# EAGLE design SensorInterface (EAGLE 8.4.1)
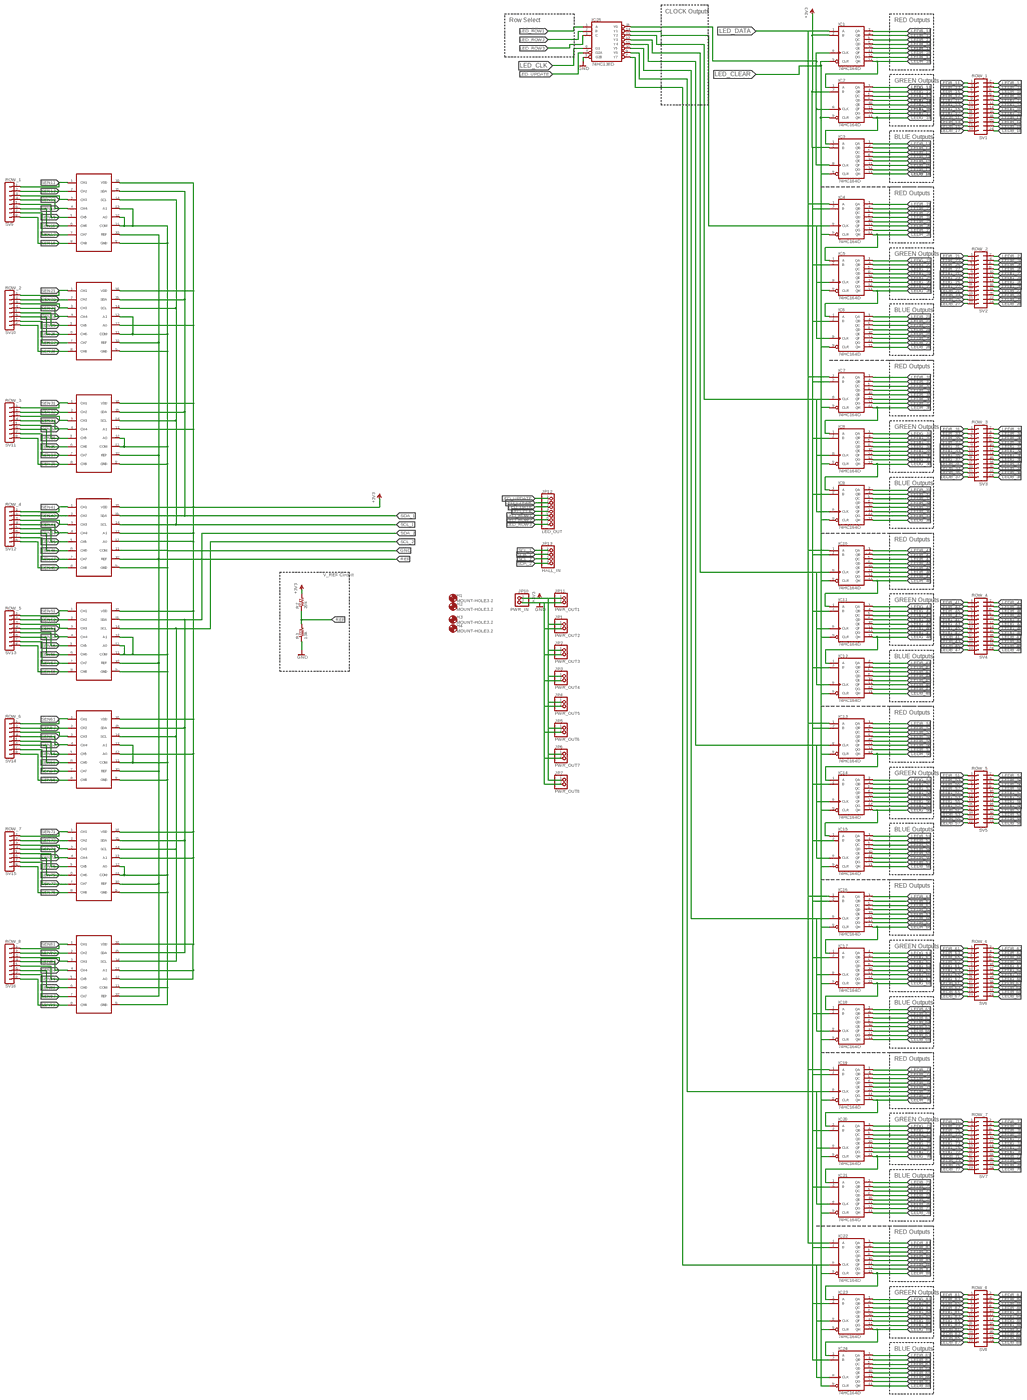
[diagram p0: schematic, sheet 1, overview]
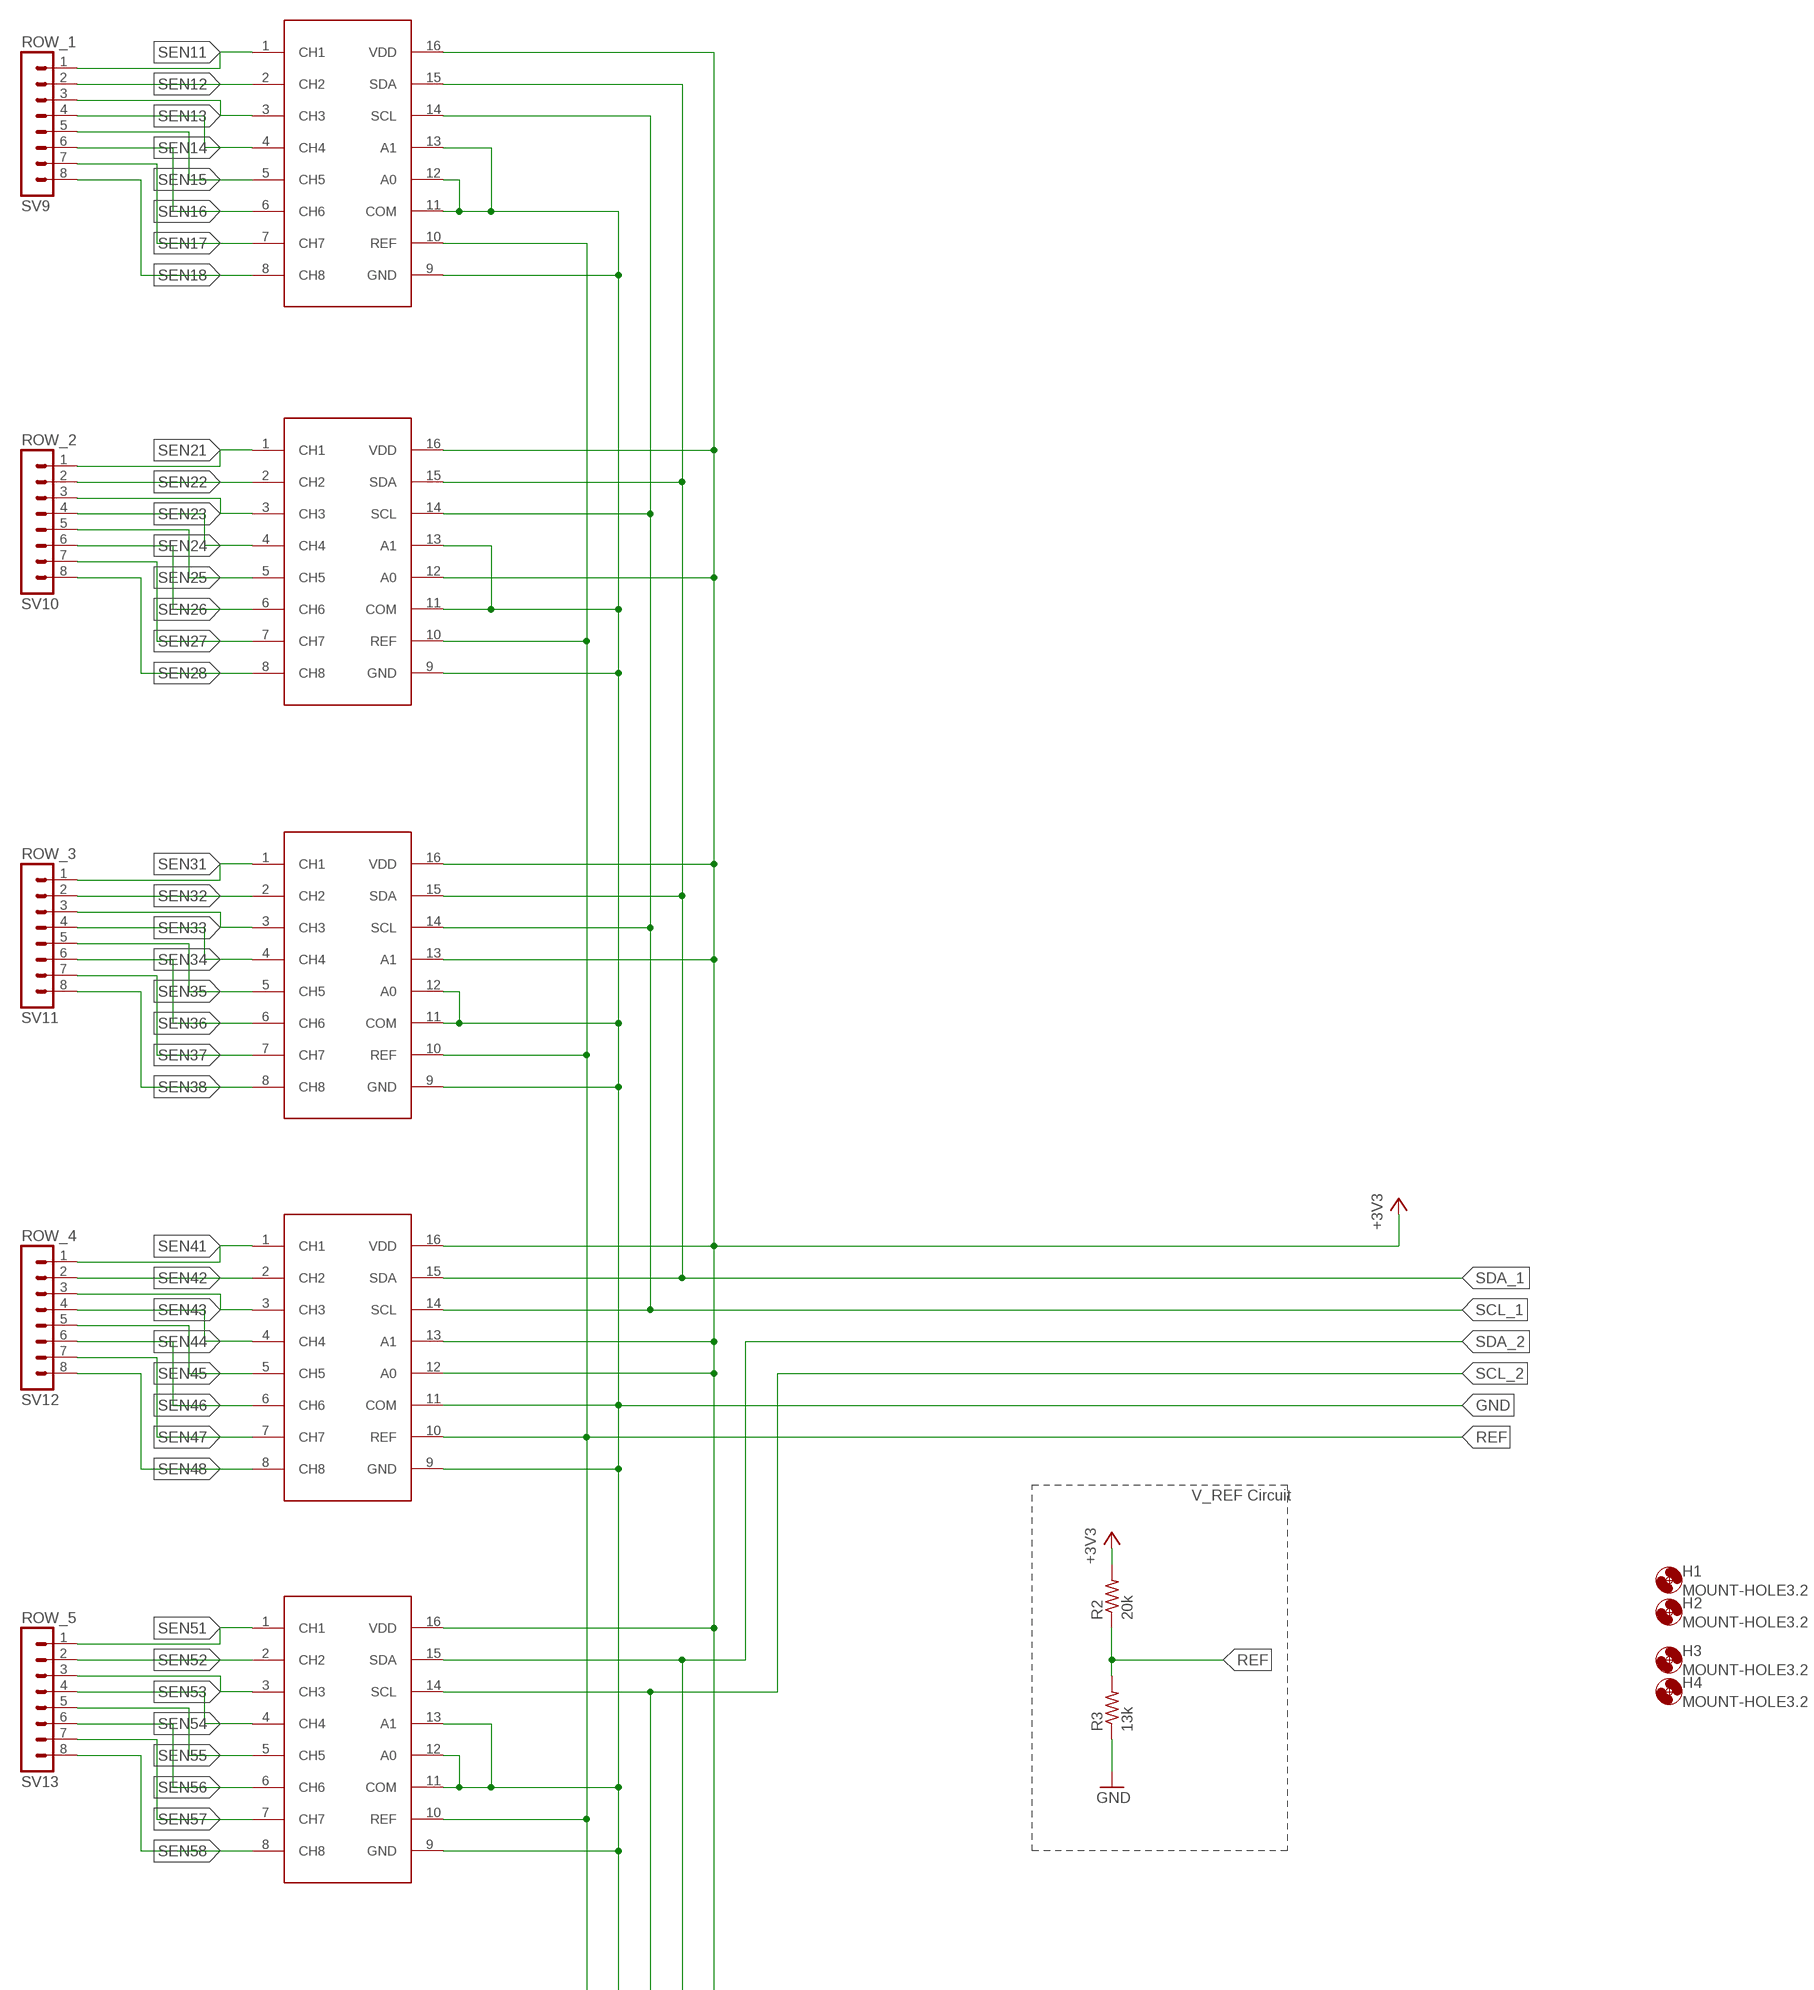
[diagram p1: schematic, sheet 1, part 1 of 4]
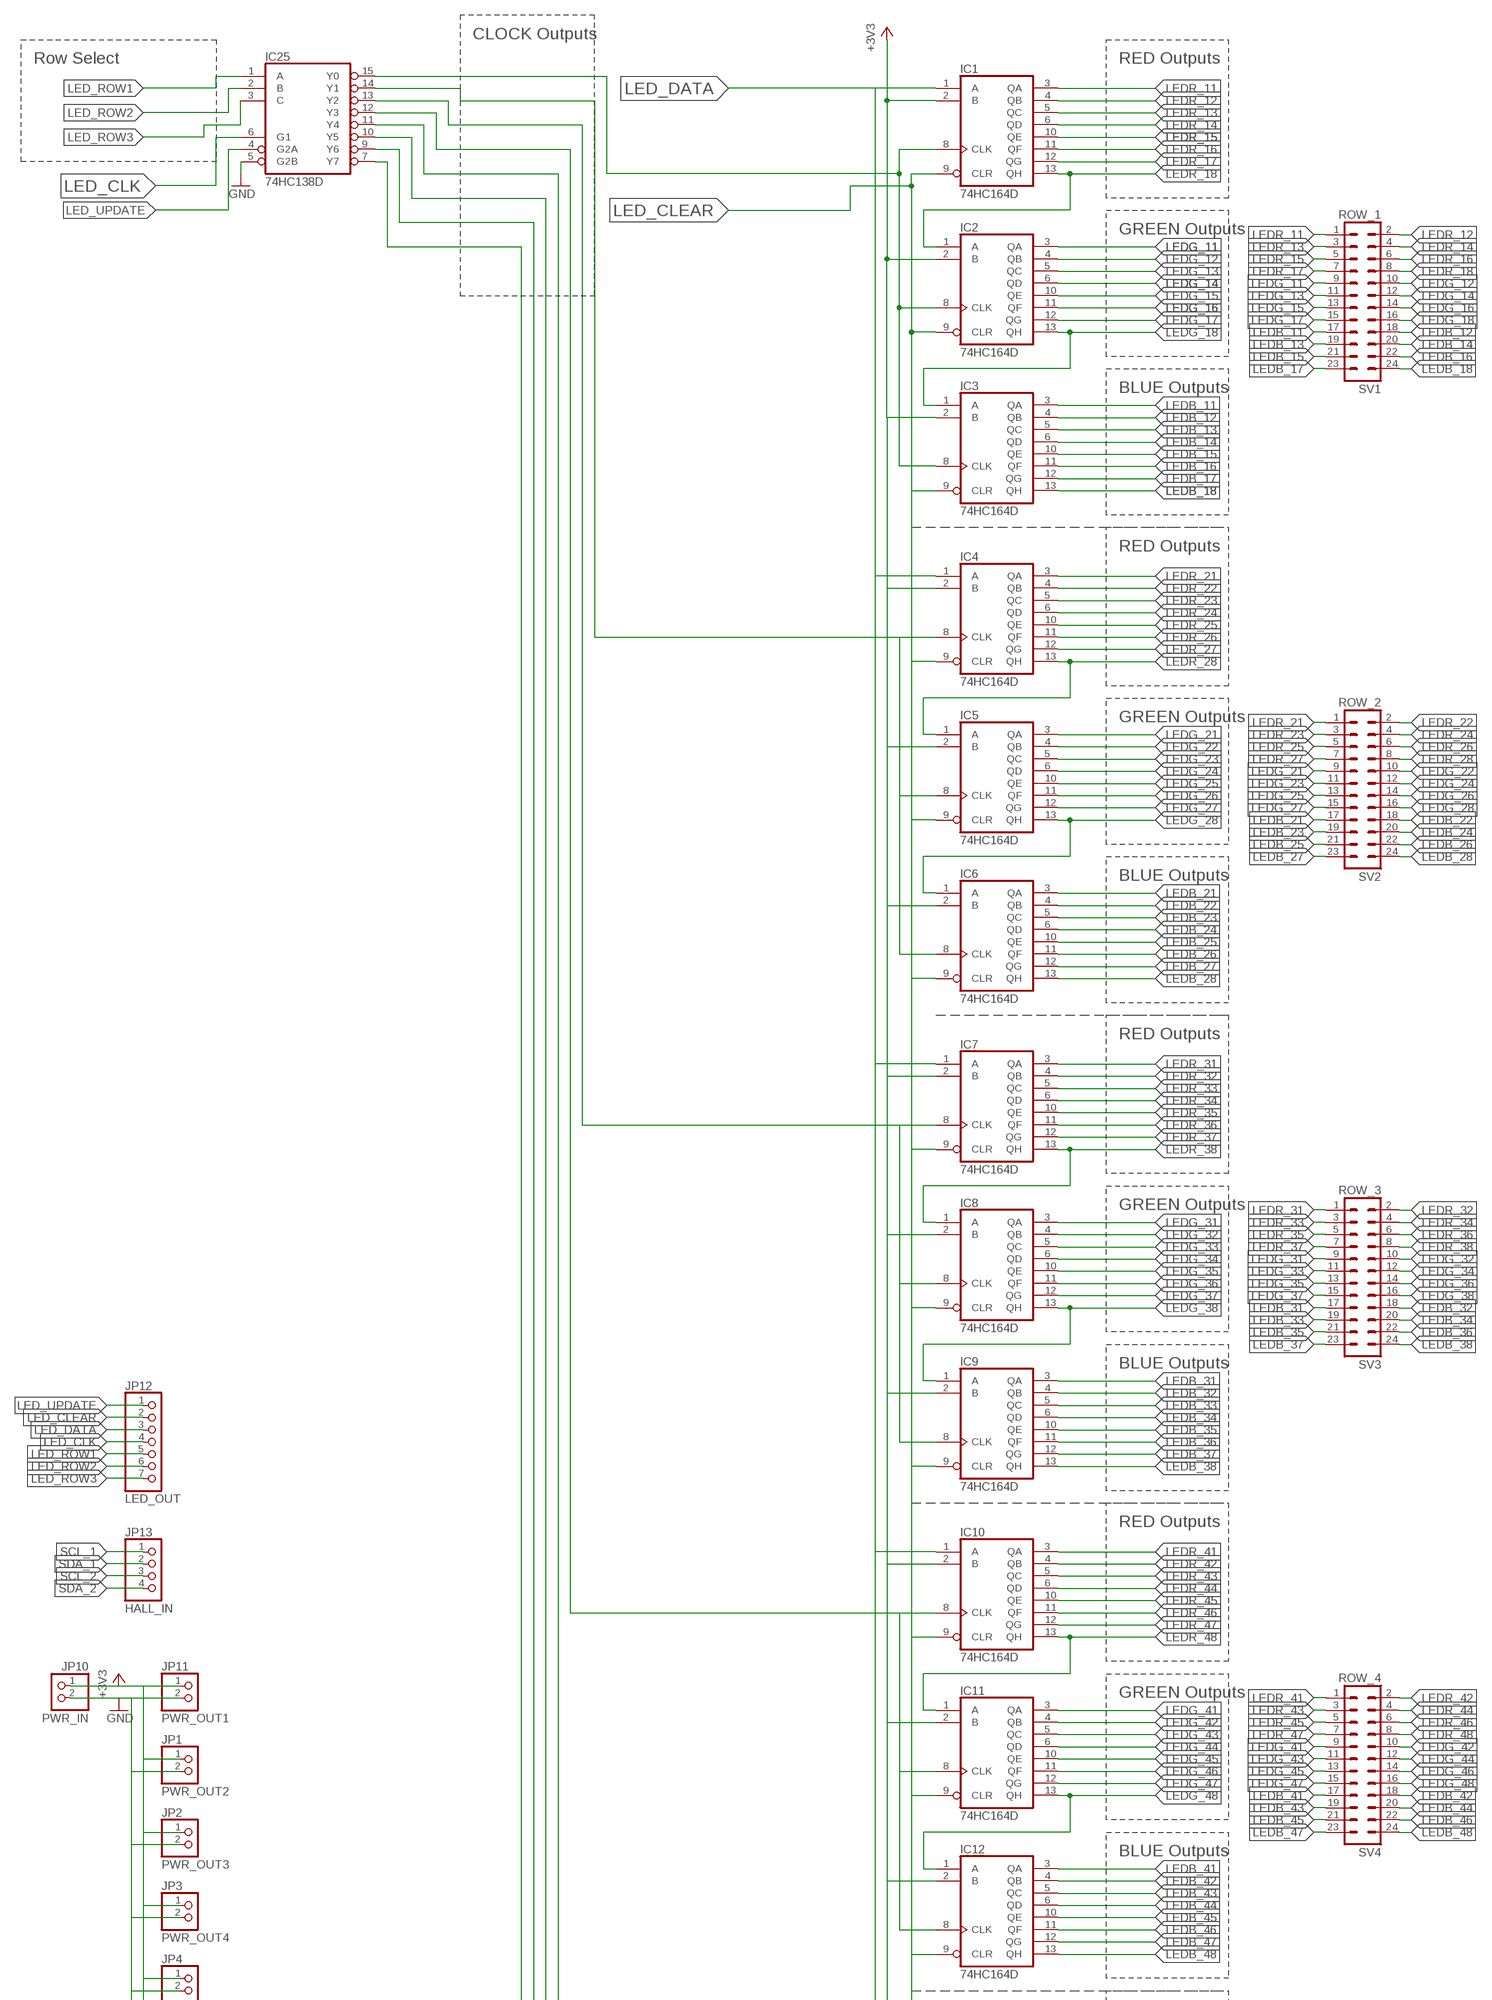
[diagram p2: schematic, sheet 1, part 2 of 4]
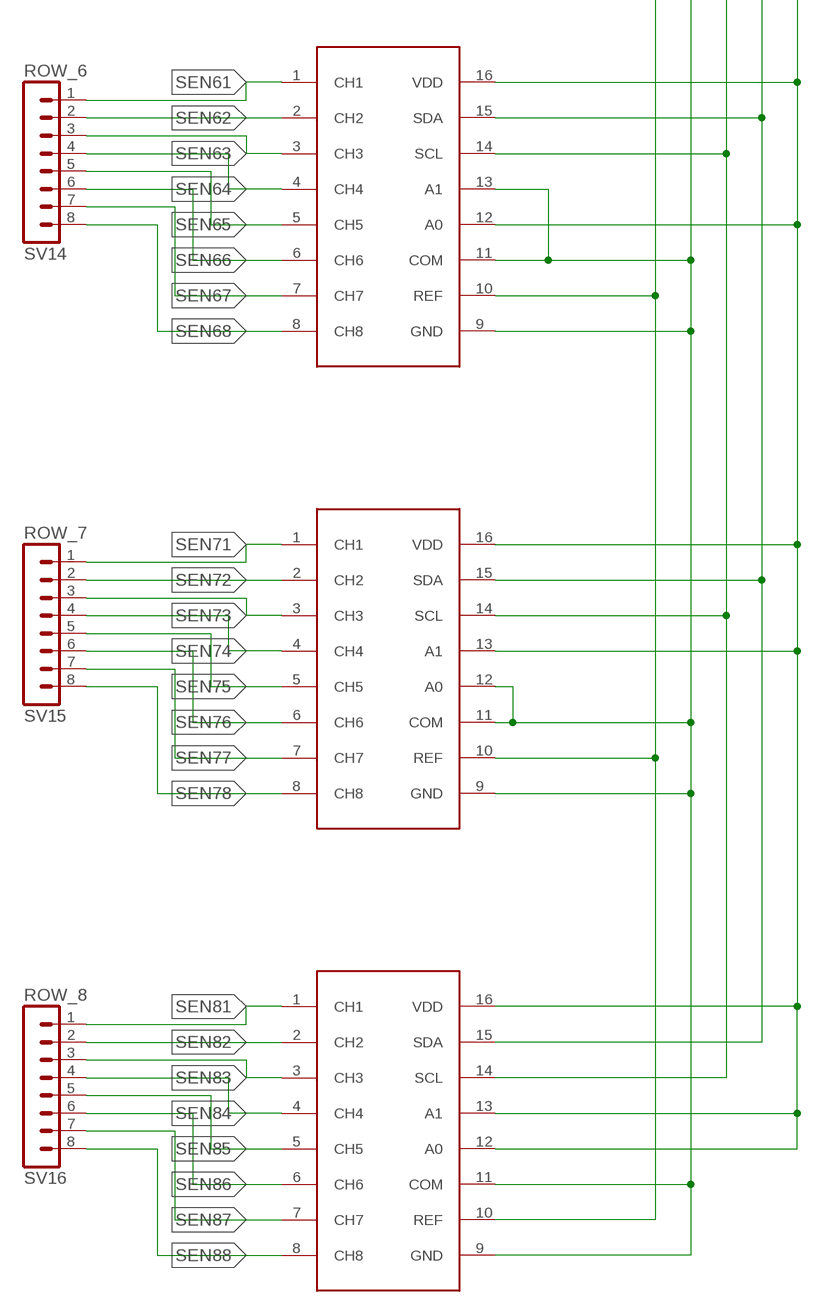
[diagram p3: schematic, sheet 1, part 3 of 4]
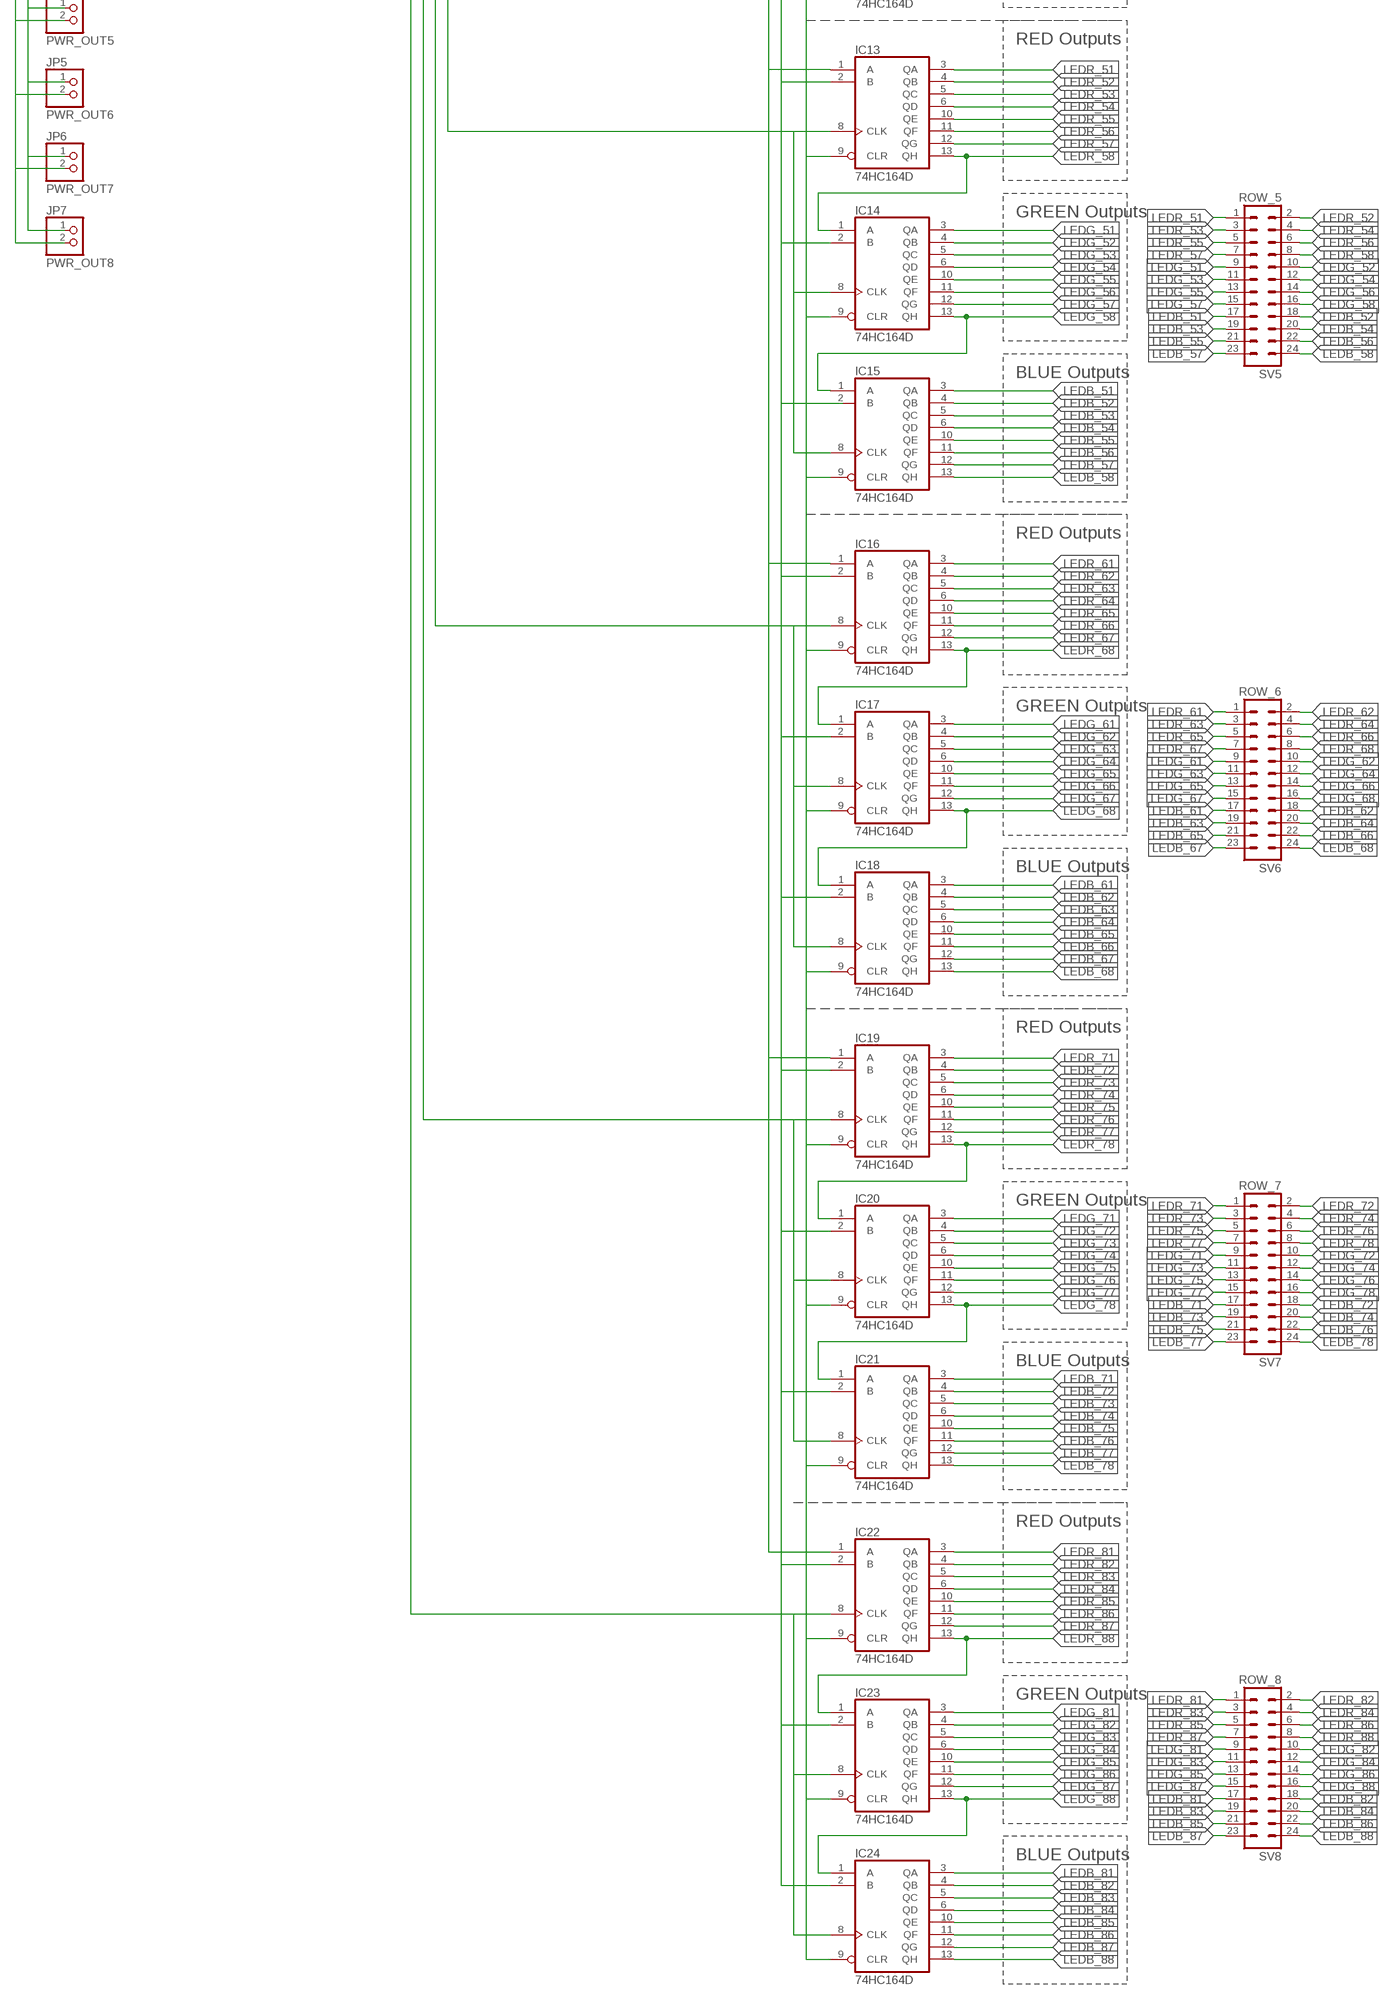
[diagram p4: schematic, sheet 1, part 4 of 4]

## Parts
H1  MOUNT-HOLE3.2  [3,2]
H2  MOUNT-HOLE3.2  [3,2]
H3  MOUNT-HOLE3.2  [3,2]
H4  MOUNT-HOLE3.2  [3,2]
IC1  74HC164D  [SO14]
IC2  74HC164D  [SO14]
IC3  74HC164D  [SO14]
IC4  74HC164D  [SO14]
IC5  74HC164D  [SO14]
IC6  74HC164D  [SO14]
IC7  74HC164D  [SO14]
IC8  74HC164D  [SO14]
IC9  74HC164D  [SO14]
IC10  74HC164D  [SO14]
IC11  74HC164D  [SO14]
IC12  74HC164D  [SO14]
IC13  74HC164D  [SO14]
IC14  74HC164D  [SO14]
IC15  74HC164D  [SO14]
IC16  74HC164D  [SO14]
IC17  74HC164D  [SO14]
IC18  74HC164D  [SO14]
IC19  74HC164D  [SO14]
IC20  74HC164D  [SO14]
IC21  74HC164D  [SO14]
IC22  74HC164D  [SO14]
IC23  74HC164D  [SO14]
IC24  74HC164D  [SO14]
IC25  74HC138D  [SO16]
JP1  PWR_OUT2  PINHD-1X2  [1X02]
JP2  PWR_OUT3  PINHD-1X2  [1X02]
JP3  PWR_OUT4  PINHD-1X2  [1X02]
JP4  PWR_OUT5  PINHD-1X2  [1X02]
JP5  PWR_OUT6  PINHD-1X2  [1X02]
JP6  PWR_OUT7  PINHD-1X2  [1X02]
JP7  PWR_OUT8  PINHD-1X2  [1X02]
JP10  PWR_IN  PINHD-1X2  [1X02]
JP11  PWR_OUT1  PINHD-1X2  [1X02]
JP12  LED_OUT  PINHD-1X7  [1X07]
JP13  HALL_IN  PINHD-1X4  [1X04]
R2  20k  R-US_R0603  [R0603]
R3  13k  R-US_R0603  [R0603]
SV1  ROW_1  MA12-2  [MA12-2]
SV2  ROW_2  MA12-2  [MA12-2]
SV3  ROW_3  MA12-2  [MA12-2]
SV4  ROW_4  MA12-2  [MA12-2]
SV5  ROW_5  MA12-2  [MA12-2]
SV6  ROW_6  MA12-2  [MA12-2]
SV7  ROW_7  MA12-2  [MA12-2]
SV8  ROW_8  MA12-2  [MA12-2]
SV9  ROW_1  MA08-1  [MA08-1]
SV10  ROW_2  MA08-1  [MA08-1]
SV11  ROW_3  MA08-1  [MA08-1]
SV12  ROW_4  MA08-1  [MA08-1]
SV13  ROW_5  MA08-1  [MA08-1]
SV14  ROW_6  MA08-1  [MA08-1]
SV15  ROW_7  MA08-1  [MA08-1]
SV16  ROW_8  MA08-1  [MA08-1]
U$1  NCD9830  [TSSOP16]
U$2  NCD9830  [TSSOP16]
U$3  NCD9830  [TSSOP16]
U$4  NCD9830  [TSSOP16]
U$5  NCD9830  [TSSOP16]
U$6  NCD9830  [TSSOP16]
U$7  NCD9830  [TSSOP16]
U$8  NCD9830  [TSSOP16]

## Nets
+3V3: IC1.2(B) IC2.2(B) IC3.2(B) IC4.2(B) IC5.2(B) IC6.2(B) IC7.2(B) IC8.2(B) IC9.2(B) IC10.2(B) IC11.2(B) IC12.2(B) IC13.2(B) IC14.2(B) IC16.2(B) IC17.2(B) IC18.2(B) IC19.2(B) IC20.2(B) IC21.2(B) IC22.2(B) IC23.2(B) IC24.2(B) JP1.1 JP2.1 JP3.1 JP4.1 JP5.1 JP6.1 JP7.1 JP10.1 JP11.1 R2.2 U$1.12(A0) U$1.16(VDD) U$2.13(A1) U$2.16(VDD) U$3.12(A0) U$3.13(A1) U$3.16(VDD) U$4.16(VDD) U$5.12(A0) U$5.16(VDD) U$6.13(A1) U$6.16(VDD) U$7.16(VDD) U$8.12(A0) U$8.13(A1) U$8.16(VDD)
CLK: IC19.8(CLK) IC20.8(CLK) IC21.8(CLK) IC25.9(Y6)
GND: IC25.5(G2B) JP1.2 JP2.2 JP3.2 JP4.2 JP5.2 JP6.2 JP7.2 JP10.2 JP11.2 R3.1 U$1.9(GND) U$1.11(COM) U$1.13(A1) U$2.9(GND) U$2.11(COM) U$2.12(A0) U$3.9(GND) U$3.11(COM) U$4.9(GND) U$4.11(COM) U$4.12(A0) U$4.13(A1) U$5.9(GND) U$5.11(COM) U$5.13(A1) U$6.9(GND) U$6.11(COM) U$6.12(A0) U$7.9(GND) U$7.11(COM) U$7.12(A0) U$7.13(A1) U$8.9(GND) U$8.11(COM)
LED_CLEAR: IC1.9(CLR) IC2.9(CLR) IC3.9(CLR) IC4.9(CLR) IC5.9(CLR) IC6.9(CLR) IC7.9(CLR) IC8.9(CLR) IC9.9(CLR) IC10.9(CLR) IC11.9(CLR) IC12.9(CLR) IC13.9(CLR) IC14.9(CLR) IC15.9(CLR) IC16.9(CLR) IC17.9(CLR) IC18.9(CLR) IC19.9(CLR) IC20.9(CLR) IC21.9(CLR) IC22.9(CLR) IC23.9(CLR) IC24.9(CLR) JP12.2
LED_CLK: IC25.6(G1) JP12.4
LED_DATA: IC1.1(A) IC4.1(A) IC7.1(A) IC10.1(A) IC13.1(A) IC16.1(A) IC19.1(A) IC22.1(A) JP12.3
LED_ROW1: IC25.1(A) JP12.5
LED_ROW2: IC25.2(B) JP12.6
LED_ROW3: IC25.3(C) JP12.7
LED_UPDATE: IC25.4(G2A) JP12.1
LEDB_11: IC3.3(QA) SV1.17
LEDB_12: IC3.4(QB) SV1.18
LEDB_13: IC3.5(QC) SV1.19
LEDB_14: IC3.6(QD) SV1.20
LEDB_15: IC3.10(QE) SV1.21
LEDB_16: IC3.11(QF) SV1.22
LEDB_17: IC3.12(QG) SV1.23
LEDB_18: IC3.13(QH) SV1.24
LEDB_21: IC6.3(QA) SV2.17
LEDB_22: IC6.4(QB) SV2.18
LEDB_23: IC6.5(QC) SV2.19
LEDB_24: IC6.6(QD) SV2.20
LEDB_25: IC6.10(QE) SV2.21
LEDB_26: IC6.11(QF) SV2.22
LEDB_27: IC6.12(QG) SV2.23
LEDB_28: IC6.13(QH) SV2.24
LEDB_31: IC9.3(QA) SV3.17
LEDB_32: IC9.4(QB) SV3.18
LEDB_33: IC9.5(QC) SV3.19
LEDB_34: IC9.6(QD) SV3.20
LEDB_35: IC9.10(QE) SV3.21
LEDB_36: IC9.11(QF) SV3.22
LEDB_37: IC9.12(QG) SV3.23
LEDB_38: IC9.13(QH) SV3.24
LEDB_41: IC12.3(QA) SV4.17
LEDB_42: IC12.4(QB) SV4.18
LEDB_43: IC12.5(QC) SV4.19
LEDB_44: IC12.6(QD) SV4.20
LEDB_45: IC12.10(QE) SV4.21
LEDB_46: IC12.11(QF) SV4.22
LEDB_47: IC12.12(QG) SV4.23
LEDB_48: IC12.13(QH) SV4.24
LEDB_51: IC15.3(QA) SV5.17
LEDB_52: IC15.4(QB) SV5.18
LEDB_53: IC15.5(QC) SV5.19
LEDB_54: IC15.6(QD) SV5.20
LEDB_55: IC15.10(QE) SV5.21
LEDB_56: IC15.11(QF) SV5.22
LEDB_57: IC15.12(QG) SV5.23
LEDB_58: IC15.13(QH) SV5.24
LEDB_61: IC18.3(QA) SV6.17
LEDB_62: IC18.4(QB) SV6.18
LEDB_63: IC18.5(QC) SV6.19
LEDB_64: IC18.6(QD) SV6.20
LEDB_65: IC18.10(QE) SV6.21
LEDB_66: IC18.11(QF) SV6.22
LEDB_67: IC18.12(QG) SV6.23
LEDB_68: IC18.13(QH) SV6.24
LEDB_71: IC21.3(QA) SV7.17
LEDB_72: IC21.4(QB) SV7.18
LEDB_73: IC21.5(QC) SV7.19
LEDB_74: IC21.6(QD) SV7.20
LEDB_75: IC21.10(QE) SV7.21
LEDB_76: IC21.11(QF) SV7.22
LEDB_77: IC21.12(QG) SV7.23
LEDB_78: IC21.13(QH) SV7.24
LEDB_81: IC24.3(QA) SV8.17
LEDB_82: IC24.4(QB) SV8.18
LEDB_83: IC24.5(QC) SV8.19
LEDB_84: IC24.6(QD) SV8.20
LEDB_85: IC24.10(QE) SV8.21
LEDB_86: IC24.11(QF) SV8.22
LEDB_87: IC24.12(QG) SV8.23
LEDB_88: IC24.13(QH) SV8.24
LEDG_11: IC2.3(QA) SV1.9
LEDG_12: IC2.4(QB) SV1.10
LEDG_13: IC2.5(QC) SV1.11
LEDG_14: IC2.6(QD) SV1.12
LEDG_15: IC2.10(QE) SV1.13
LEDG_16: IC2.11(QF) SV1.14
LEDG_17: IC2.12(QG) SV1.15
LEDG_18: IC2.13(QH) IC3.1(A) SV1.16
LEDG_21: IC5.3(QA) SV2.9
LEDG_22: IC5.4(QB) SV2.10
LEDG_23: IC5.5(QC) SV2.11
LEDG_24: IC5.6(QD) SV2.12
LEDG_25: IC5.10(QE) SV2.13
LEDG_26: IC5.11(QF) SV2.14
LEDG_27: IC5.12(QG) SV2.15
LEDG_28: IC5.13(QH) IC6.1(A) SV2.16
LEDG_31: IC8.3(QA) SV3.9
LEDG_32: IC8.4(QB) SV3.10
LEDG_33: IC8.5(QC) SV3.11
LEDG_34: IC8.6(QD) SV3.12
LEDG_35: IC8.10(QE) SV3.13
LEDG_36: IC8.11(QF) SV3.14
LEDG_37: IC8.12(QG) SV3.15
LEDG_38: IC8.13(QH) IC9.1(A) SV3.16
LEDG_41: IC11.3(QA) SV4.9
LEDG_42: IC11.4(QB) SV4.10
LEDG_43: IC11.5(QC) SV4.11
LEDG_44: IC11.6(QD) SV4.12
LEDG_45: IC11.10(QE) SV4.13
LEDG_46: IC11.11(QF) SV4.14
LEDG_47: IC11.12(QG) SV4.15
LEDG_48: IC11.13(QH) IC12.1(A) SV4.16
LEDG_51: IC14.3(QA) SV5.9
LEDG_52: IC14.4(QB) SV5.10
LEDG_53: IC14.5(QC) SV5.11
LEDG_54: IC14.6(QD) SV5.12
LEDG_55: IC14.10(QE) SV5.13
LEDG_56: IC14.11(QF) SV5.14
LEDG_57: IC14.12(QG) SV5.15
LEDG_58: IC14.13(QH) IC15.1(A) SV5.16
LEDG_61: IC17.3(QA) SV6.9
LEDG_62: IC17.4(QB) SV6.10
LEDG_63: IC17.5(QC) SV6.11
LEDG_64: IC17.6(QD) SV6.12
LEDG_65: IC17.10(QE) SV6.13
LEDG_66: IC17.11(QF) SV6.14
LEDG_67: IC17.12(QG) SV6.15
LEDG_68: IC17.13(QH) IC18.1(A) SV6.16
LEDG_71: IC20.3(QA) SV7.9
LEDG_72: IC20.4(QB) SV7.10
LEDG_73: IC20.5(QC) SV7.11
LEDG_74: IC20.6(QD) SV7.12
LEDG_75: IC20.10(QE) SV7.13
LEDG_76: IC20.11(QF) SV7.14
LEDG_77: IC20.12(QG) SV7.15
LEDG_78: IC20.13(QH) IC21.1(A) SV7.16
LEDG_81: IC23.3(QA) SV8.9
LEDG_82: IC23.4(QB) SV8.10
LEDG_83: IC23.5(QC) SV8.11
LEDG_84: IC23.6(QD) SV8.12
LEDG_85: IC23.10(QE) SV8.13
LEDG_86: IC23.11(QF) SV8.14
LEDG_87: IC23.12(QG) SV8.15
LEDG_88: IC23.13(QH) IC24.1(A) SV8.16
LEDR_11: IC1.3(QA) SV1.1
LEDR_12: IC1.4(QB) SV1.2
LEDR_13: IC1.5(QC) SV1.3
LEDR_14: IC1.6(QD) SV1.4
LEDR_15: IC1.10(QE) SV1.5
LEDR_16: IC1.11(QF) SV1.6
LEDR_17: IC1.12(QG) SV1.7
LEDR_18: IC1.13(QH) IC2.1(A) SV1.8
LEDR_21: IC4.3(QA) SV2.1
LEDR_22: IC4.4(QB) SV2.2
LEDR_23: IC4.5(QC) SV2.3
LEDR_24: IC4.6(QD) SV2.4
LEDR_25: IC4.10(QE) SV2.5
LEDR_26: IC4.11(QF) SV2.6
LEDR_27: IC4.12(QG) SV2.7
LEDR_28: IC4.13(QH) IC5.1(A) SV2.8
LEDR_31: IC7.3(QA) SV3.1
LEDR_32: IC7.4(QB) SV3.2
LEDR_33: IC7.5(QC) SV3.3
LEDR_34: IC7.6(QD) SV3.4
LEDR_35: IC7.10(QE) SV3.5
LEDR_36: IC7.11(QF) SV3.6
LEDR_37: IC7.12(QG) SV3.7
LEDR_38: IC7.13(QH) IC8.1(A) SV3.8
LEDR_41: IC10.3(QA) SV4.1
LEDR_42: IC10.4(QB) SV4.2
LEDR_43: IC10.5(QC) SV4.3
LEDR_44: IC10.6(QD) SV4.4
LEDR_45: IC10.10(QE) SV4.5
LEDR_46: IC10.11(QF) SV4.6
LEDR_47: IC10.12(QG) SV4.7
LEDR_48: IC10.13(QH) IC11.1(A) SV4.8
LEDR_51: IC13.3(QA) SV5.1
LEDR_52: IC13.4(QB) SV5.2
LEDR_53: IC13.5(QC) SV5.3
LEDR_54: IC13.6(QD) SV5.4
LEDR_55: IC13.10(QE) SV5.5
LEDR_56: IC13.11(QF) SV5.6
LEDR_57: IC13.12(QG) SV5.7
LEDR_58: IC13.13(QH) IC14.1(A) SV5.8
LEDR_61: IC16.3(QA) SV6.1
LEDR_62: IC16.4(QB) SV6.2
LEDR_63: IC16.5(QC) SV6.3
LEDR_64: IC16.6(QD) SV6.4
LEDR_65: IC16.10(QE) SV6.5
LEDR_66: IC16.11(QF) SV6.6
LEDR_67: IC16.12(QG) SV6.7
LEDR_68: IC16.13(QH) IC17.1(A) SV6.8
LEDR_71: IC19.3(QA) SV7.1
LEDR_72: IC19.4(QB) SV7.2
LEDR_73: IC19.5(QC) SV7.3
LEDR_74: IC19.6(QD) SV7.4
LEDR_75: IC19.10(QE) SV7.5
LEDR_76: IC19.11(QF) SV7.6
LEDR_77: IC19.12(QG) SV7.7
LEDR_78: IC19.13(QH) IC20.1(A) SV7.8
LEDR_81: IC22.3(QA) SV8.1
LEDR_82: IC22.4(QB) SV8.2
LEDR_83: IC22.5(QC) SV8.3
LEDR_84: IC22.6(QD) SV8.4
LEDR_85: IC22.10(QE) SV8.5
LEDR_86: IC22.11(QF) SV8.6
LEDR_87: IC22.12(QG) SV8.7
LEDR_88: IC22.13(QH) IC23.1(A) SV8.8
N$26: IC1.8(CLK) IC2.8(CLK) IC3.8(CLK) IC25.15(Y0)
N$49: IC4.8(CLK) IC5.8(CLK) IC6.8(CLK) IC25.14(Y1)
N$50: IC7.8(CLK) IC8.8(CLK) IC9.8(CLK) IC25.13(Y2)
N$51: IC10.8(CLK) IC11.8(CLK) IC12.8(CLK) IC25.12(Y3)
N$52: IC13.8(CLK) IC14.8(CLK) IC15.8(CLK) IC25.11(Y4)
N$53: IC16.8(CLK) IC17.8(CLK) IC18.8(CLK) IC25.10(Y5)
N$55: IC22.8(CLK) IC23.8(CLK) IC24.8(CLK) IC25.7(Y7)
REF: R2.1 R3.2 U$1.10(REF) U$2.10(REF) U$3.10(REF) U$4.10(REF) U$5.10(REF) U$6.10(REF) U$7.10(REF) U$8.10(REF)
SCL_1: JP13.1 U$1.14(SCL) U$2.14(SCL) U$3.14(SCL) U$7.14(SCL)
SCL_2: JP13.3 U$4.14(SCL) U$5.14(SCL) U$6.14(SCL) U$8.14(SCL)
SDA_1: JP13.2 U$1.15(SDA) U$2.15(SDA) U$3.15(SDA) U$7.15(SDA)
SDA_2: JP13.4 U$4.15(SDA) U$5.15(SDA) U$6.15(SDA) U$8.15(SDA)
SEN11: SV9.1 U$7.1(CH1)
SEN12: SV9.2 U$7.2(CH2)
SEN13: SV9.3 U$7.3(CH3)
SEN14: SV9.4 U$7.4(CH4)
SEN15: SV9.5 U$7.5(CH5)
SEN16: SV9.6 U$7.6(CH6)
SEN17: SV9.7 U$7.7(CH7)
SEN18: SV9.8 U$7.8(CH8)
SEN21: SV10.1
SEN22: SV10.2
SEN23: SV10.3
SEN24: SV10.4
SEN25: SV10.5
SEN26: SV10.6
SEN27: SV10.7
SEN28: SV10.8
SEN31: SV11.1
SEN32: SV11.2
SEN33: SV11.3
SEN34: SV11.4
SEN35: SV11.5
SEN36: SV11.6
SEN37: SV11.7
SEN38: SV11.8
SEN41: SV12.1
SEN42: SV12.2
SEN43: SV12.3
SEN44: SV12.4
SEN45: SV12.5
SEN46: SV12.6
SEN47: SV12.7
SEN48: SV12.8
SEN51: SV13.1
SEN52: SV13.2
SEN53: SV13.3
SEN54: SV13.4
SEN55: SV13.5
SEN56: SV13.6
SEN57: SV13.7
SEN58: SV13.8
SEN61: SV14.1
SEN62: SV14.2
SEN63: SV14.3
SEN64: SV14.4
SEN65: SV14.5
SEN66: SV14.6
SEN67: SV14.7
SEN68: SV14.8
SEN71: SV15.1
SEN72: SV15.2
SEN73: SV15.3
SEN74: SV15.4
SEN75: SV15.5
SEN76: SV15.6
SEN77: SV15.7
SEN78: SV15.8
SEN81: SV16.1
SEN82: SV16.2
SEN83: SV16.3
SEN84: SV16.4
SEN85: SV16.5
SEN86: SV16.6
SEN87: SV16.7
SEN88: SV16.8
Unconnected: IC15.2(B) U$1.1(CH1) U$1.2(CH2) U$1.3(CH3) U$1.4(CH4) U$1.5(CH5) U$1.6(CH6) U$1.7(CH7) U$1.8(CH8) U$2.1(CH1) U$2.2(CH2) U$2.3(CH3) U$2.4(CH4) U$2.5(CH5) U$2.6(CH6) U$2.7(CH7) U$2.8(CH8) U$3.1(CH1) U$3.2(CH2) U$3.3(CH3) U$3.4(CH4) U$3.5(CH5) U$3.6(CH6) U$3.7(CH7) U$3.8(CH8) U$4.1(CH1) U$4.2(CH2) U$4.3(CH3) U$4.4(CH4) U$4.5(CH5) U$4.6(CH6) U$4.7(CH7) U$4.8(CH8) U$5.1(CH1) U$5.2(CH2) U$5.3(CH3) U$5.4(CH4) U$5.5(CH5) U$5.6(CH6) U$5.7(CH7) U$5.8(CH8) U$6.1(CH1) U$6.2(CH2) U$6.3(CH3) U$6.4(CH4) U$6.5(CH5) U$6.6(CH6) U$6.7(CH7) U$6.8(CH8) U$8.1(CH1) U$8.2(CH2) U$8.3(CH3) U$8.4(CH4) U$8.5(CH5) U$8.6(CH6) U$8.7(CH7) U$8.8(CH8)

## Notes on the sheet
- CLOCK Outputs
- Row Select | RED Outputs
- GREEN Outputs
- BLUE Outputs
- RED Outputs
- GREEN Outputs
- BLUE Outputs
- RED Outputs
- GREEN Outputs
- BLUE Outputs
- RED Outputs
- V_REF Circuit
- GREEN Outputs
- BLUE Outputs
- RED Outputs
- GREEN Outputs
- BLUE Outputs
- RED Outputs
- GREEN Outputs
- BLUE Outputs
- RED Outputs
- GREEN Outputs
- BLUE Outputs
- RED Outputs
- GREEN Outputs
- BLUE Outputs

## Power pins joined to a net without a drawn wire
GND: IC1.7(GND) IC2.7(GND) IC3.7(GND) IC4.7(GND) IC5.7(GND) IC6.7(GND) IC7.7(GND) IC8.7(GND) IC9.7(GND) IC10.7(GND) IC11.7(GND) IC12.7(GND) IC13.7(GND) IC14.7(GND) IC15.7(GND) IC16.7(GND) IC17.7(GND) IC18.7(GND) IC19.7(GND) IC20.7(GND) IC21.7(GND) IC22.7(GND) IC23.7(GND) IC24.7(GND) IC25.8(GND)
VCC: IC1.14(VCC) IC2.14(VCC) IC3.14(VCC) IC4.14(VCC) IC5.14(VCC) IC6.14(VCC) IC7.14(VCC) IC8.14(VCC) IC9.14(VCC) IC10.14(VCC) IC11.14(VCC) IC12.14(VCC) IC13.14(VCC) IC14.14(VCC) IC15.14(VCC) IC16.14(VCC) IC17.14(VCC) IC18.14(VCC) IC19.14(VCC) IC20.14(VCC) IC21.14(VCC) IC22.14(VCC) IC23.14(VCC) IC24.14(VCC) IC25.16(VCC)

## Library data of the parts
H1-H4 = holes:MOUNT-HOLE: MOUNTING HOLE with drill center marker
IC1-IC24 = 74xx-eu:74*164: 8-bit parallel out SHIFT REGISTER
IC25 = 74xx-eu:74*138: 3-line to 8-line DECODER/DEMULTIPLEXER
JP1-JP7 JP10 JP11 = pinhead:PINHD-1X2: PIN HEADER
JP12 = pinhead:PINHD-1X7: PIN HEADER
JP13 = pinhead:PINHD-1X4: PIN HEADER
R2 R3 = rcl:R-US_: RESISTOR, American symbol
SV1-SV8 = con-lstb:MA12-2: PIN HEADER; OC_FARNELL: unknown; OC_NEWARK: unknown
SV9-SV16 = con-lstb:MA08-1: PIN HEADER; OC_FARNELL: unknown; OC_NEWARK: unknown
U$1-U$8 = DesignReview:NCD9830

## Board
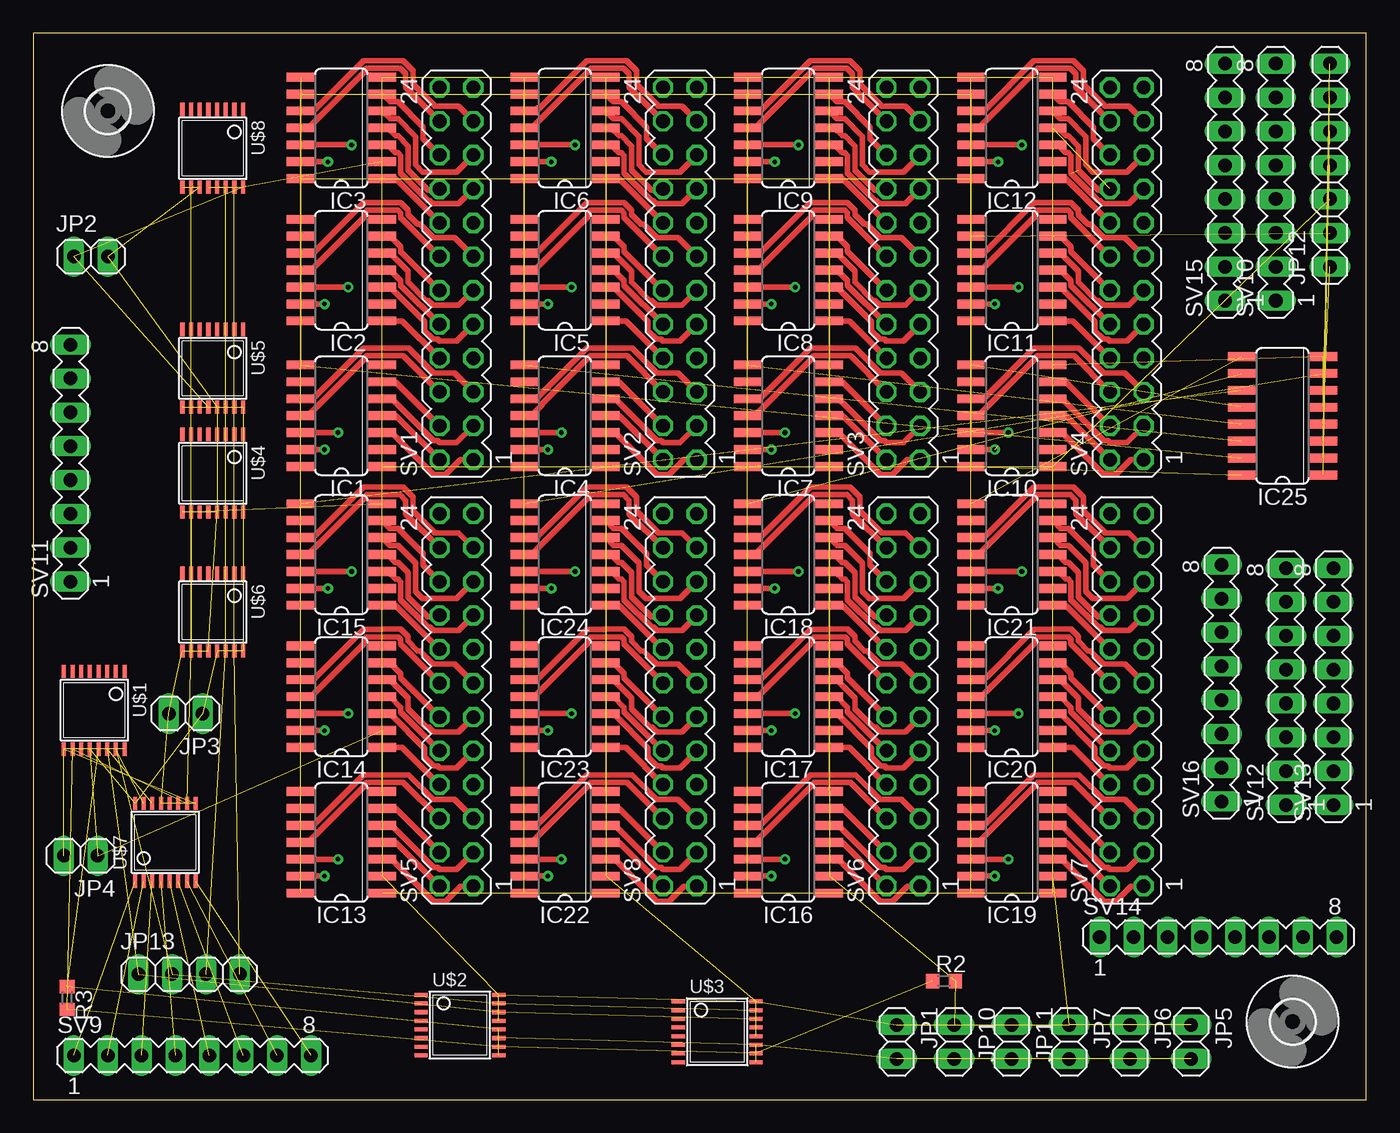
[diagram p5: board, top side]
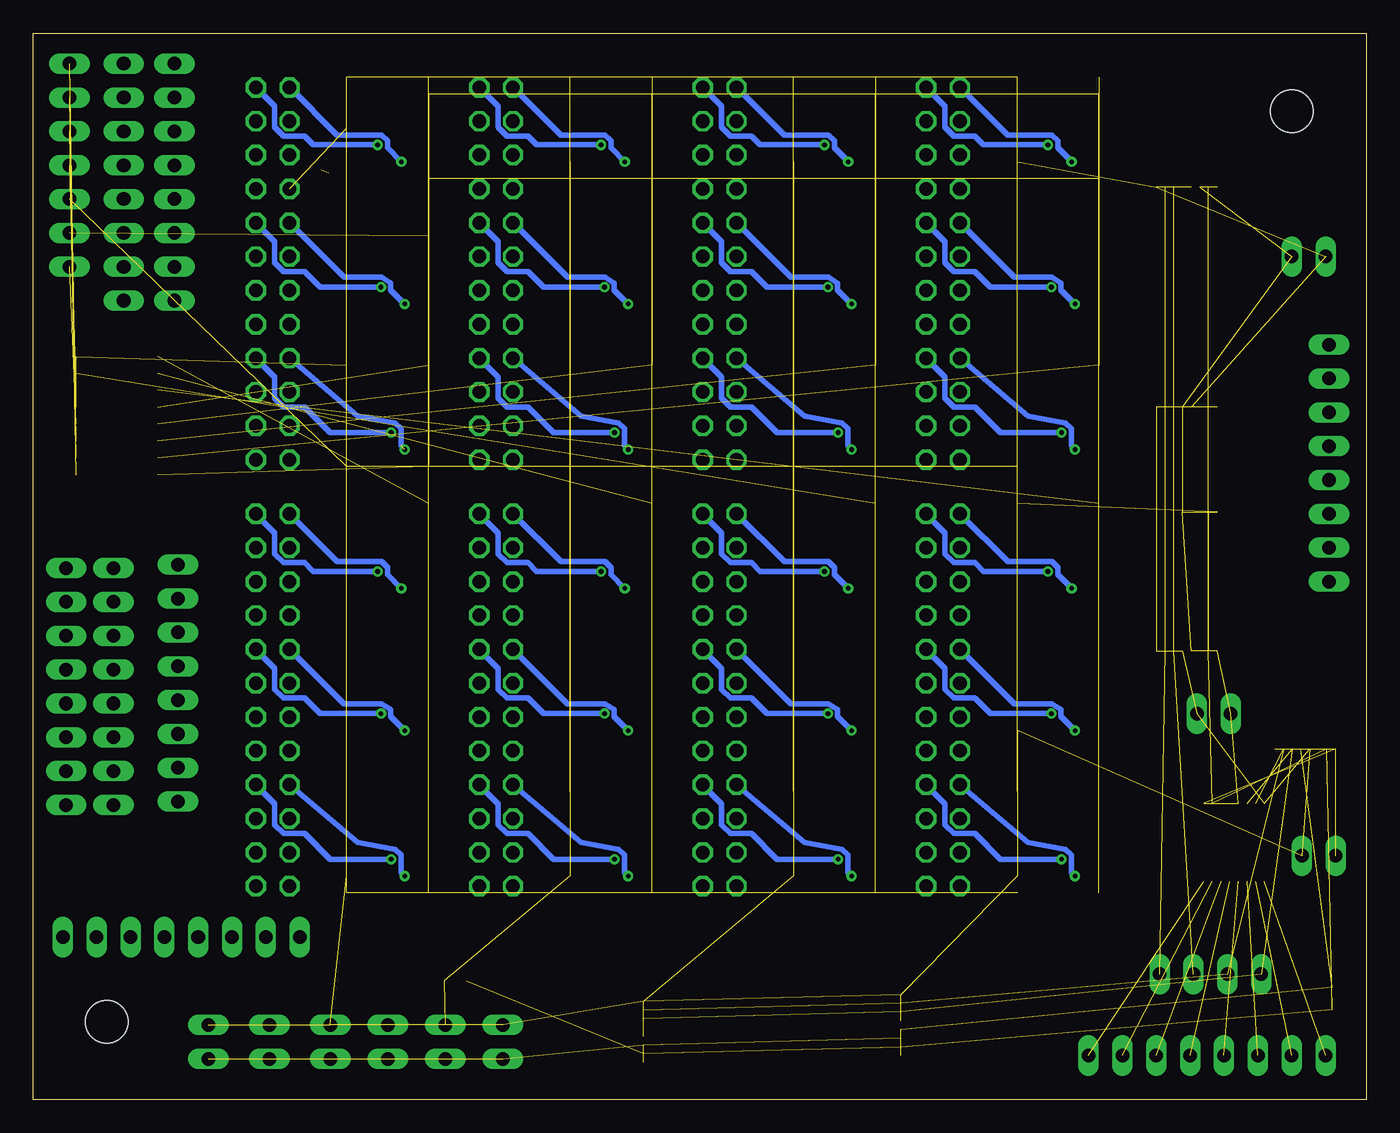
[diagram p6: board, bottom side, seen from below]

Size 100 x 80 mm. Coordinates in mm from the lower left corner, seen from the top.
Outline: 0,0 100,0 100,80 0,80 0,0
Copper layers (1*16): Top 0.035mm / dielectric 1.5mm / Bottom 0.035mm
Design rules "default *": minimum track width 10mil, minimum drill 0.35mm, track to track 6mil, track to pad 6mil, pad to pad 6mil, via to via 6mil, smd to smd 6mil, copper to edge 50mil, drill to drill 6mil, minimum pad ring 10mil, minimum via ring 8mil, stop-mask expansion 4mil, vias tented up to drill 0mil, thermal gap 10mil

### Footprints (pad centres in the part's own frame; a part is rotated, then mirrored left to right if it is on the bottom)
3,2 = hole 3.2: 0,0
SO14 = smd 0.66 x 2.032: 1 -3.81,-3.073; 2 -2.54,-3.073; 3 -1.27,-3.073; 4 0,-3.073; 5 1.27,-3.073; 6 2.54,-3.073; 7 3.81,-3.073; 8 3.81,3.073; 9 2.54,3.073; 10 1.27,3.073; 11 0,3.073; 12 -1.27,3.073; 13 -2.54,3.073; 14 -3.81,3.073
SO16 = smd 0.66 x 2.032: 1 -4.445,-3.073; 2 -3.175,-3.073; 3 -1.905,-3.073; 4 -0.635,-3.073; 5 0.635,-3.073; 6 1.905,-3.073; 7 3.175,-3.073; 8 4.445,-3.073; 9 4.445,3.073; 10 3.175,3.073; 11 1.905,3.073; 12 0.635,3.073; 13 -0.635,3.073; 14 -1.905,3.073; 15 -3.175,3.073; 16 -4.445,3.073
1X02 = drill 1.016 long: 1 -1.27,0; 2 1.27,0
1X07 = drill 1.016 long: 1 -7.62,0; 2 -5.08,0; 3 -2.54,0; 4 0,0; 5 2.54,0; 6 5.08,0; 7 7.62,0
1X04 = drill 1.016 long: 1 -3.81,0; 2 -1.27,0; 3 1.27,0; 4 3.81,0
R0603 = smd 1 x 1.1: 1 -0.85,0; 2 0.85,0
MA12-2 = drill 1.016 octagon: 1 -13.97,-1.27; 2 -13.97,1.27; 3 -11.43,-1.27; 4 -11.43,1.27; 5 -8.89,-1.27; 6 -8.89,1.27; 7 -6.35,-1.27; 8 -6.35,1.27; 9 -3.81,-1.27; 10 -3.81,1.27; 11 -1.27,-1.27; 12 -1.27,1.27; 13 1.27,-1.27; 14 1.27,1.27; 15 3.81,-1.27; 16 3.81,1.27; 17 6.35,-1.27; 18 6.35,1.27; 19 8.89,-1.27; 20 8.89,1.27; 21 11.43,-1.27; 22 11.43,1.27; 23 13.97,-1.27; 24 13.97,1.27
MA08-1 = drill 1.016 long: 1 -8.89,0; 2 -6.35,0; 3 -3.81,0; 4 -1.27,0; 5 1.27,0; 6 3.81,0; 7 6.35,0; 8 8.89,0
TSSOP16 = smd 0.305 x 0.991: 1 -2.275,-2.918; 2 -1.625,-2.918; 3 -0.975,-2.918; 4 -0.325,-2.918; 5 0.325,-2.918; 6 0.975,-2.918; 7 1.625,-2.918; 8 2.275,-2.918; 9 2.275,2.918; 10 1.625,2.918; 11 0.975,2.918; 12 0.325,2.918; 13 -0.325,2.918; 14 -0.975,2.918; 15 -1.625,2.918; 16 -2.275,2.918

### Placement (x,y rotation side)
H1  5.59,74.17 0 top
H2  94.49,5.84 0 top
H3  -100.33,-17.78 0 top  (outside the outline)
H4  -91.44,-17.78 0 top  (outside the outline)
IC1  23.11,51.31 90 top
IC2  23.11,62.23 90 top
IC3  23.11,72.9 90 top
IC4  39.88,51.31 90 top
IC5  39.88,62.23 90 top
IC6  39.88,72.9 90 top
IC7  56.64,51.31 90 top
IC8  56.64,62.23 90 top
IC9  56.64,72.9 90 top
IC10  73.41,51.31 90 top
IC11  73.41,62.23 90 top
IC12  73.41,72.9 90 top
IC13  23.11,19.3 90 top
IC14  23.11,30.23 90 top
IC15  23.11,40.89 90 top
IC16  56.64,19.3 90 top
IC17  56.64,30.23 90 top
IC18  56.64,40.89 90 top
IC19  73.41,19.3 90 top
IC20  73.41,30.23 90 top
IC21  73.41,40.89 90 top
IC22  39.88,19.3 90 top
IC23  39.88,30.23 90 top
IC24  39.88,40.89 90 top
IC25  93.73,51.31 90 top
JP1  64.77,4.32 270 top
JP2  4.32,63.25 0 top
JP3  11.43,28.96 180 top
JP4  3.56,18.29 180 top
JP5  86.87,4.32 270 top
JP6  82.3,4.32 270 top
JP7  77.72,4.32 270 top
JP10  69.09,4.32 270 top
JP11  73.41,4.32 270 top
JP12  97.28,70.1 90 top
JP13  11.68,9.4 0 top
R2  68.33,8.89 0 top
R3  2.54,7.62 270 top
SV1  31.75,61.98 90 top
SV2  48.51,61.98 90 top
SV3  65.28,61.98 90 top
SV4  82.04,61.98 90 top
SV5  31.75,29.97 90 top
SV6  65.28,29.97 90 top
SV7  82.04,29.97 90 top
SV8  48.51,29.97 90 top
SV9  11.94,3.3 0 top
SV10  93.22,68.83 90 top
SV11  2.79,47.75 90 top
SV12  93.98,30.99 90 top
SV13  97.54,30.99 90 top
SV14  88.9,12.19 0 top
SV15  89.41,68.83 90 top
SV16  89.15,31.24 90 top
U$1  4.57,29.21 180 top
U$2  32,5.59 270 top
U$3  51.31,5.08 270 top
U$4  13.46,46.99 180 top
U$5  13.46,54.86 180 top
U$6  13.46,36.58 180 top
U$7  9.91,19.3 0 top
U$8  13.46,71.37 180 top

### Tracks (layer width: path | path; a pad name or v marks a point on that pad's centre or on a via)
+3V3  (48 unrouted)
CLK  (3 unrouted)
GND  (59 unrouted)
LED_CLEAR  (24 unrouted)
LED_CLK  (1 unrouted)
LED_DATA  (8 unrouted)
LED_ROW1  (1 unrouted)
LED_ROW2  (1 unrouted)
LED_ROW3  (1 unrouted)
LED_UPDATE  (1 unrouted)
LEDB_11
  Top 0.406: SV1.17 31.9,67.21 30.02,67.21 29.77,67.45 29.61,67.45 27.56,69.5 27.56,70.83 27.35,71.04 27.18,71.04 26.59,71.63 IC3.3
LEDB_12
  Top 0.406: SV1.18 30.38,68.23 29.62,68.23 28.12,69.73 28.12,71.55 27.35,72.31 27.18,72.31 26.59,72.9 IC3.4
LEDB_13
  Top 0.406: IC3.5 26.77,73.58 27.35,73.58 28.68,72.26 28.68,70.13 29.21,69.6 31.75,69.6 SV1.19
LEDB_14
  Top 0.406: SV1.20 29.23,72.11 29.23,72.97 27.35,74.85 26.77,74.85 IC3.6
LEDB_15
  Top 0.406: SV1.21 31.9,74.52 30.15,74.52 28.5,76.18 28.5,77.19 27.74,77.95 24.79,77.95 21.01,74.17 IC3.10
LEDB_16
  Top 0.406: IC3.11 20.62,72.9 24.82,77.09 24.82,77.19 25.02,77.39 27.51,77.39 27.94,76.96 27.94,75.95 SV1.22
LEDB_17  (via drill 0.35)
  Top 0.406: IC3.12 v23.88,71.63
  Bottom 0.406: v23.88,71.63 28.7,71.63 29.36,72.29 30.94,72.29 31.6,72.94 31.6,74.52 SV1.23
LEDB_18  (via drill 0.35)
  Top 0.406: IC3.13 v22.1,70.36
  Bottom 0.406: SV1.24 26.9,72.36 23.57,72.36 23.14,71.93 23.14,71.4 v22.1,70.36
LEDB_21
  Top 0.406: SV2.17 48.67,67.21 46.78,67.21 46.54,67.45 46.37,67.45 44.32,69.5 44.32,70.83 44.12,71.04 43.94,71.04 43.36,71.63 IC6.3
LEDB_22
  Top 0.406: SV2.18 47.15,68.23 46.38,68.23 44.88,69.73 44.88,71.55 44.12,72.31 43.94,72.31 43.36,72.9 IC6.4
LEDB_23
  Top 0.406: IC6.5 43.54,73.58 44.12,73.58 45.44,72.26 45.44,70.13 45.97,69.6 48.51,69.6 SV2.19
LEDB_24
  Top 0.406: SV2.20 46,72.11 46,72.97 44.12,74.85 43.54,74.85 IC6.6
LEDB_25
  Top 0.406: 37.85,74.42 37.59,74.17 IC6.10 37.77,74.17 41.56,77.95 44.5,77.95 45.26,77.19 45.26,76.18 46.92,74.52 48.67,74.52 SV2.21
LEDB_26
  Top 0.406: IC6.11 37.38,72.9 41.58,77.09 41.58,77.19 41.79,77.39 44.27,77.39 44.7,76.96 44.7,75.95 SV2.22
LEDB_27  (via drill 0.35)
  Top 0.406: IC6.12 v40.64,71.63
  Bottom 0.406: v40.64,71.63 45.47,71.63 46.13,72.29 47.71,72.29 48.36,72.94 48.36,74.52 SV2.23
LEDB_28  (via drill 0.35)
  Top 0.406: IC6.13 v38.86,70.36
  Bottom 0.406: SV2.24 43.66,72.36 40.34,72.36 39.91,71.93 39.91,71.4 v38.86,70.36
LEDB_31
  Top 0.406: SV3.17 65.43,67.21 63.55,67.21 63.3,67.45 63.13,67.45 61.09,69.5 61.09,70.83 60.88,71.04 60.71,71.04 60.12,71.63 IC9.3
LEDB_32
  Top 0.406: SV3.18 63.91,68.23 63.15,68.23 61.65,69.73 61.65,71.55 60.88,72.31 60.71,72.31 60.12,72.9 IC9.4
LEDB_33
  Top 0.406: IC9.5 60.3,73.58 60.88,73.58 62.2,72.26 62.2,70.13 62.74,69.6 65.28,69.6 SV3.19
LEDB_34
  Top 0.406: SV3.20 62.76,72.11 62.76,72.97 60.88,74.85 60.3,74.85 IC9.6
LEDB_35
  Top 0.406: SV3.21 65.43,74.52 63.68,74.52 62.03,76.18 62.03,77.19 61.27,77.95 58.32,77.95 54.54,74.17 IC9.10
LEDB_36
  Top 0.406: IC9.11 54.15,72.9 58.34,77.09 58.34,77.19 58.55,77.39 61.04,77.39 61.47,76.96 61.47,75.95 SV3.22
LEDB_37  (via drill 0.35)
  Top 0.406: IC9.12 v57.4,71.63
  Bottom 0.406: v57.4,71.63 62.23,71.63 62.89,72.29 64.47,72.29 65.13,72.94 65.13,74.52 SV3.23
LEDB_38  (via drill 0.35)
  Top 0.406: IC9.13 v55.63,70.36
  Bottom 0.406: SV3.24 60.42,72.36 57.1,72.36 56.67,71.93 56.67,71.4 v55.63,70.36
LEDB_41  (1 unrouted)
  Top 0.406: 80.77,68.33 80.67,68.23 79.91,68.23 78.41,69.73 78.41,71.55 77.64,72.31 77.47,72.31 76.89,72.9 76.48,72.9 | SV4.17 82.19,67.21 80.31,67.21 80.07,67.45 79.9,67.45 77.85,69.5 77.85,70.83 77.64,71.04 77.47,71.04 76.89,71.63 IC12.3
LEDB_42  (1 unrouted)
LEDB_43
  Top 0.406: IC12.5 77.06,73.58 77.64,73.58 78.97,72.26 78.97,70.13 79.5,69.6 82.04,69.6 SV4.19
LEDB_44
  Top 0.406: SV4.20 79.53,72.11 79.53,72.97 77.64,74.85 77.06,74.85 IC12.6
LEDB_45
  Top 0.406: SV4.21 82.19,74.52 80.44,74.52 78.79,76.18 78.79,77.19 78.03,77.95 75.08,77.95 71.3,74.17 IC12.10
LEDB_46
  Top 0.406: IC12.11 70.91,72.9 75.11,77.09 75.11,77.19 75.32,77.39 77.8,77.39 78.23,76.96 78.23,75.95 SV4.22
LEDB_47  (via drill 0.35)
  Top 0.406: IC12.12 v74.17,71.63
  Bottom 0.406: v74.17,71.63 78.99,71.63 79.65,72.29 81.23,72.29 81.89,72.94 81.89,74.52 SV4.23
LEDB_48  (via drill 0.35)
  Top 0.406: IC12.13 v72.39,70.36
  Bottom 0.406: SV4.24 77.19,72.36 73.86,72.36 73.43,71.93 73.43,71.4 v72.39,70.36
LEDB_51
  Top 0.406: SV5.17 31.9,35.2 30.02,35.2 29.77,35.45 29.61,35.45 27.56,37.49 27.56,38.83 27.35,39.04 27.18,39.04 26.59,39.62 IC15.3
LEDB_52
  Top 0.406: SV5.18 30.38,36.22 29.62,36.22 28.12,37.73 28.12,39.54 27.35,40.31 27.18,40.31 26.59,40.89 IC15.4
LEDB_53
  Top 0.406: IC15.5 26.77,41.58 27.35,41.58 28.68,40.25 28.68,38.12 29.21,37.59 31.75,37.59 SV5.19
LEDB_54
  Top 0.406: SV5.20 29.23,40.11 29.23,40.97 27.35,42.85 26.77,42.85 IC15.6
LEDB_55
  Top 0.406: SV5.21 31.9,42.52 30.15,42.52 28.5,44.17 28.5,45.19 27.74,45.95 24.79,45.95 21.01,42.16 IC15.10
LEDB_56
  Top 0.406: IC15.11 20.62,40.89 24.82,45.09 24.82,45.18 25.02,45.39 27.51,45.39 27.94,44.96 27.94,43.94 SV5.22
LEDB_57  (via drill 0.35)
  Top 0.406: IC15.12 v23.88,39.62
  Bottom 0.406: v23.88,39.62 28.7,39.62 29.36,40.28 30.94,40.28 31.6,40.94 31.6,42.52 SV5.23
LEDB_58  (via drill 0.35)
  Top 0.406: IC15.13 v22.1,38.35
  Bottom 0.406: SV5.24 26.9,40.36 23.57,40.36 23.14,39.93 23.14,39.4 v22.1,38.35
LEDB_61
  Top 0.406: SV6.17 65.43,35.2 63.55,35.2 63.3,35.45 63.13,35.45 61.09,37.49 61.09,38.83 60.88,39.04 60.71,39.04 60.12,39.62 IC18.3
LEDB_62
  Top 0.406: SV6.18 63.91,36.22 63.15,36.22 61.65,37.73 61.65,39.54 60.88,40.31 60.71,40.31 60.12,40.89 IC18.4
LEDB_63
  Top 0.406: IC18.5 60.3,41.58 60.88,41.58 62.2,40.25 62.2,38.12 62.74,37.59 65.28,37.59 SV6.19
LEDB_64
  Top 0.406: SV6.20 62.76,40.11 62.76,40.97 60.88,42.85 60.3,42.85 IC18.6
LEDB_65
  Top 0.406: SV6.21 65.43,42.52 63.68,42.52 62.03,44.17 62.03,45.19 61.27,45.95 58.32,45.95 54.54,42.16 IC18.10
LEDB_66
  Top 0.406: IC18.11 54.15,40.89 58.34,45.09 58.34,45.18 58.55,45.39 61.04,45.39 61.47,44.96 61.47,43.94 SV6.22
LEDB_67  (via drill 0.35)
  Top 0.406: IC18.12 v57.4,39.62
  Bottom 0.406: v57.4,39.62 62.23,39.62 62.89,40.28 64.47,40.28 65.13,40.94 65.13,42.52 SV6.23
LEDB_68  (via drill 0.35)
  Top 0.406: IC18.13 v55.63,38.35
  Bottom 0.406: SV6.24 60.42,40.36 57.1,40.36 56.67,39.93 56.67,39.4 v55.63,38.35
LEDB_71
  Top 0.406: SV7.17 82.19,35.2 80.31,35.2 80.07,35.45 79.9,35.45 77.85,37.49 77.85,38.83 77.64,39.04 77.47,39.04 76.89,39.62 IC21.3
LEDB_72
  Top 0.406: SV7.18 80.67,36.22 79.91,36.22 78.41,37.73 78.41,39.54 77.64,40.31 77.47,40.31 76.89,40.89 IC21.4
LEDB_73
  Top 0.406: IC21.5 77.06,41.58 77.64,41.58 78.97,40.25 78.97,38.12 79.5,37.59 82.04,37.59 SV7.19
LEDB_74
  Top 0.406: SV7.20 79.53,40.11 79.53,40.97 77.64,42.85 77.06,42.85 IC21.6
LEDB_75
  Top 0.406: SV7.21 82.19,42.52 80.44,42.52 78.79,44.17 78.79,45.19 78.03,45.95 75.08,45.95 71.3,42.16 IC21.10
LEDB_76
  Top 0.406: IC21.11 70.91,40.89 75.11,45.09 75.11,45.18 75.32,45.39 77.8,45.39 78.23,44.96 78.23,43.94 SV7.22
LEDB_77  (via drill 0.35)
  Top 0.406: IC21.12 v74.17,39.62
  Bottom 0.406: v74.17,39.62 78.99,39.62 79.65,40.28 81.23,40.28 81.89,40.94 81.89,42.52 SV7.23
LEDB_78  (via drill 0.35)
  Top 0.406: IC21.13 v72.39,38.35
  Bottom 0.406: SV7.24 77.19,40.36 73.86,40.36 73.43,39.93 73.43,39.4 v72.39,38.35
LEDB_81
  Top 0.406: SV8.17 48.67,35.2 46.78,35.2 46.54,35.45 46.37,35.45 44.32,37.49 44.32,38.83 44.12,39.04 43.94,39.04 43.36,39.62 IC24.3
LEDB_82
  Top 0.406: SV8.18 47.15,36.22 46.38,36.22 44.88,37.73 44.88,39.54 44.12,40.31 43.94,40.31 43.36,40.89 IC24.4
LEDB_83
  Top 0.406: IC24.5 43.54,41.58 44.12,41.58 45.44,40.25 45.44,38.12 45.97,37.59 48.51,37.59 SV8.19
LEDB_84
  Top 0.406: SV8.20 46,40.11 46,40.97 44.12,42.85 43.54,42.85 IC24.6
LEDB_85
  Top 0.406: SV8.21 48.67,42.52 46.92,42.52 45.26,44.17 45.26,45.19 44.5,45.95 41.56,45.95 37.77,42.16 IC24.10
LEDB_86
  Top 0.406: IC24.11 37.38,40.89 41.58,45.09 41.58,45.18 41.79,45.39 44.27,45.39 44.7,44.96 44.7,43.94 SV8.22
LEDB_87  (via drill 0.35)
  Top 0.406: IC24.12 v40.64,39.62
  Bottom 0.406: v40.64,39.62 45.47,39.62 46.13,40.28 47.71,40.28 48.36,40.94 48.36,42.52 SV8.23
LEDB_88  (via drill 0.35)
  Top 0.406: IC24.13 v38.86,38.35
  Bottom 0.406: SV8.24 43.66,40.36 40.34,40.36 39.91,39.93 39.91,39.4 v38.86,38.35
LEDG_11
  Top 0.406: IC2.3 26.77,60.96 29.36,58.36 29.36,57.7 30.02,57.05 30.33,57.05 30.48,56.9 31.75,56.9 SV1.9
LEDG_12
  Top 0.406: SV1.10 27.56,61.09 27.56,61.44 26.77,62.23 IC2.4
LEDG_13
  Top 0.406: SV1.11 31.9,59.59 30.02,59.59 29.65,59.96 29.48,59.96 28.12,61.32 28.12,62.15 26.77,63.5 IC2.5
LEDG_14
  Top 0.406: SV1.12 27.56,63.63 27.56,63.98 26.77,64.77 IC2.6
LEDG_15
  Top 0.406: IC2.10 21.01,63.5 24.79,67.28 26.14,67.28 26.16,67.31 27.56,67.31 28.12,66.75 28.12,66.4 28.84,65.67 29.01,65.67 30.02,64.67 31.6,64.67 SV1.13
LEDG_16
  Top 0.406: IC2.11 20.83,62.23 24.82,66.22 24.82,66.52 25.02,66.73 27.35,66.73 27.56,66.52 27.56,66.17 SV1.14
LEDG_17  (via drill 0.35)
  Top 0.406: IC2.12 v23.62,60.96
  Bottom 0.406: v23.62,60.96 28.19,60.96 29.36,62.13 30.94,62.13 31.6,62.78 31.6,64.36 SV1.15
LEDG_18  (via drill 0.35)
  Top 0.406: IC2.13 v21.84,59.69 | IC3.1 27.18,69.09 SV1.16
  Bottom 0.406: SV1.16 26.39,61.69 23.57,61.69 22.89,61.26 22.89,60.73 v21.84,59.69
LEDG_21
  Top 0.406: IC5.3 43.53,60.96 46.13,58.36 46.13,57.7 46.78,57.05 47.09,57.05 47.24,56.9 48.51,56.9 SV2.9
LEDG_22
  Top 0.406: SV2.10 44.32,61.09 44.32,61.44 43.53,62.23 IC5.4
LEDG_23
  Top 0.406: SV2.11 48.67,59.59 46.78,59.59 46.41,59.96 46.24,59.96 44.88,61.32 44.88,62.15 43.53,63.5 IC5.5
LEDG_24
  Top 0.406: SV2.12 44.32,63.63 44.32,63.98 43.53,64.77 IC5.6
LEDG_25
  Top 0.406: IC5.10 37.77,63.5 41.56,67.28 42.9,67.28 42.93,67.31 44.32,67.31 44.88,66.75 44.88,66.4 45.61,65.67 45.78,65.67 46.78,64.67 48.36,64.67 SV2.13
LEDG_26
  Top 0.406: IC5.11 37.59,62.23 41.58,66.22 41.58,66.52 41.79,66.73 44.12,66.73 44.32,66.52 44.32,66.17 SV2.14
LEDG_27  (via drill 0.35)
  Top 0.406: IC5.12 v40.39,60.96
  Bottom 0.406: v40.39,60.96 44.96,60.96 46.13,62.13 47.71,62.13 48.36,62.78 48.36,64.36 SV2.15
LEDG_28  (via drill 0.35)
  Top 0.406: IC5.13 v38.61,59.69 | IC6.1 43.94,69.09 SV2.16
  Bottom 0.406: SV2.16 43.15,61.69 40.34,61.69 39.65,61.26 39.65,60.73 v38.61,59.69
LEDG_31
  Top 0.406: IC8.3 60.29,60.96 62.89,58.36 62.89,57.7 63.55,57.05 63.86,57.05 64.01,56.9 65.28,56.9 SV3.9
LEDG_32
  Top 0.406: SV3.10 61.09,61.09 61.09,61.44 60.29,62.23 IC8.4
LEDG_33
  Top 0.406: SV3.11 65.43,59.59 63.55,59.59 63.17,59.96 63.01,59.96 61.65,61.32 61.65,62.15 60.29,63.5 IC8.5
LEDG_34
  Top 0.406: SV3.12 61.09,63.63 61.09,63.98 60.29,64.77 IC8.6
LEDG_35
  Top 0.406: IC8.10 54.54,63.5 58.32,67.28 59.66,67.28 59.69,67.31 61.09,67.31 61.65,66.75 61.65,66.4 62.37,65.67 62.54,65.67 63.55,64.67 65.13,64.67 SV3.13
LEDG_36
  Top 0.406: IC8.11 54.36,62.23 58.34,66.22 58.34,66.52 58.55,66.73 60.88,66.73 61.09,66.52 61.09,66.17 SV3.14
LEDG_37  (via drill 0.35)
  Top 0.406: IC8.12 v57.15,60.96
  Bottom 0.406: v57.15,60.96 61.72,60.96 62.89,62.13 64.47,62.13 65.13,62.78 65.13,64.36 SV3.15
LEDG_38  (via drill 0.35)
  Top 0.406: IC8.13 v55.37,59.69 | IC9.1 60.71,69.09 SV3.16
  Bottom 0.406: SV3.16 59.92,61.69 57.1,61.69 56.42,61.26 56.42,60.73 v55.37,59.69
LEDG_41
  Top 0.406: IC11.3 77.06,60.96 79.65,58.36 79.65,57.7 80.31,57.05 80.62,57.05 80.77,56.9 82.04,56.9 SV4.9
LEDG_42
  Top 0.406: SV4.10 77.85,61.09 77.85,61.44 77.06,62.23 IC11.4
LEDG_43
  Top 0.406: SV4.11 82.19,59.59 80.31,59.59 79.94,59.96 79.77,59.96 78.41,61.32 78.41,62.15 77.06,63.5 IC11.5
LEDG_44
  Top 0.406: SV4.12 77.85,63.63 77.85,63.98 77.06,64.77 IC11.6
LEDG_45
  Top 0.406: IC11.10 71.3,63.5 75.08,67.28 76.43,67.28 76.45,67.31 77.85,67.31 78.41,66.75 78.41,66.4 79.14,65.67 79.3,65.67 80.31,64.67 81.89,64.67 SV4.13
LEDG_46
  Top 0.406: IC11.11 71.12,62.23 75.11,66.22 75.11,66.52 75.32,66.73 77.64,66.73 77.85,66.52 77.85,66.17 SV4.14
LEDG_47  (via drill 0.35)
  Top 0.406: IC11.12 v73.91,60.96
  Bottom 0.406: v73.91,60.96 78.49,60.96 79.65,62.13 81.23,62.13 81.89,62.78 81.89,64.36 SV4.15
LEDG_48  (via drill 0.35)
  Top 0.406: IC11.13 v72.14,59.69 | IC12.1 77.47,69.09 SV4.16
  Bottom 0.406: SV4.16 76.68,61.69 73.86,61.69 73.18,61.26 73.18,60.73 v72.14,59.69
LEDG_51
  Top 0.406: IC14.3 26.77,28.96 29.36,26.36 29.36,25.7 30.02,25.04 30.33,25.04 30.48,24.89 31.75,24.89 SV5.9
LEDG_52
  Top 0.406: SV5.10 27.56,29.08 27.56,29.43 26.77,30.23 IC14.4
LEDG_53
  Top 0.406: SV5.11 31.9,27.58 30.02,27.58 29.65,27.95 29.48,27.95 28.12,29.31 28.12,30.14 26.77,31.5 IC14.5
LEDG_54
  Top 0.406: SV5.12 27.56,31.62 27.56,31.97 26.77,32.77 IC14.6
LEDG_55
  Top 0.406: IC14.10 21.01,31.5 24.79,35.28 26.14,35.28 26.16,35.31 27.56,35.31 28.12,34.74 28.12,34.39 28.84,33.67 29.01,33.67 30.02,32.66 31.6,32.66 SV5.13
LEDG_56
  Top 0.406: IC14.11 20.83,30.23 24.82,34.21 24.82,34.51 25.02,34.72 27.35,34.72 27.56,34.51 27.56,34.16 SV5.14
LEDG_57  (via drill 0.35)
  Top 0.406: IC14.12 v23.62,28.96
  Bottom 0.406: v23.62,28.96 28.19,28.96 29.36,30.12 30.94,30.12 31.6,30.78 31.6,32.36 SV5.15
LEDG_58  (via drill 0.35)
  Top 0.406: IC14.13 v21.84,27.69 | IC15.1 27.18,37.08 SV5.16
  Bottom 0.406: SV5.16 26.39,29.69 23.57,29.69 22.89,29.26 22.89,28.73 v21.84,27.69
LEDG_61
  Top 0.406: IC17.3 60.29,28.96 62.89,26.36 62.89,25.7 63.55,25.04 63.86,25.04 64.01,24.89 65.28,24.89 SV6.9
LEDG_62
  Top 0.406: SV6.10 61.09,29.08 61.09,29.43 60.29,30.23 IC17.4
LEDG_63
  Top 0.406: SV6.11 65.43,27.58 63.55,27.58 63.17,27.95 63.01,27.95 61.65,29.31 61.65,30.14 60.29,31.5 IC17.5
LEDG_64
  Top 0.406: SV6.12 61.09,31.62 61.09,31.97 60.29,32.77 IC17.6
LEDG_65
  Top 0.406: IC17.10 54.54,31.5 58.32,35.28 59.66,35.28 59.69,35.31 61.09,35.31 61.65,34.74 61.65,34.39 62.37,33.67 62.54,33.67 63.55,32.66 65.13,32.66 SV6.13
LEDG_66
  Top 0.406: IC17.11 54.36,30.23 58.34,34.21 58.34,34.51 58.55,34.72 60.88,34.72 61.09,34.51 61.09,34.16 SV6.14
LEDG_67  (via drill 0.35)
  Top 0.406: IC17.12 v57.15,28.96
  Bottom 0.406: v57.15,28.96 61.72,28.96 62.89,30.12 64.47,30.12 65.13,30.78 65.13,32.36 SV6.15
LEDG_68  (via drill 0.35)
  Top 0.406: IC17.13 v55.37,27.69 | IC18.1 60.71,37.08 SV6.16
  Bottom 0.406: SV6.16 59.92,29.69 57.1,29.69 56.42,29.26 56.42,28.73 v55.37,27.69
LEDG_71
  Top 0.406: IC20.3 77.06,28.96 79.65,26.36 79.65,25.7 80.31,25.04 80.62,25.04 80.77,24.89 82.04,24.89 SV7.9
LEDG_72
  Top 0.406: SV7.10 77.85,29.08 77.85,29.43 77.06,30.23 IC20.4
LEDG_73
  Top 0.406: SV7.11 82.19,27.58 80.31,27.58 79.94,27.95 79.77,27.95 78.41,29.31 78.41,30.14 77.06,31.5 IC20.5
LEDG_74
  Top 0.406: SV7.12 77.85,31.62 77.85,31.97 77.06,32.77 IC20.6
LEDG_75
  Top 0.406: IC20.10 71.3,31.5 75.08,35.28 76.43,35.28 76.45,35.31 77.85,35.31 78.41,34.74 78.41,34.39 79.14,33.67 79.3,33.67 80.31,32.66 81.89,32.66 SV7.13
LEDG_76
  Top 0.406: IC20.11 71.12,30.23 75.11,34.21 75.11,34.51 75.32,34.72 77.64,34.72 77.85,34.51 77.85,34.16 SV7.14
LEDG_77  (via drill 0.35)
  Top 0.406: IC20.12 v73.91,28.96
  Bottom 0.406: v73.91,28.96 78.49,28.96 79.65,30.12 81.23,30.12 81.89,30.78 81.89,32.36 SV7.15
LEDG_78  (via drill 0.35)
  Top 0.406: IC20.13 v72.14,27.69 | IC21.1 77.47,37.08 SV7.16
  Bottom 0.406: SV7.16 76.68,29.69 73.86,29.69 73.18,29.26 73.18,28.73 v72.14,27.69
LEDG_81
  Top 0.406: IC23.3 43.53,28.96 46.13,26.36 46.13,25.7 46.78,25.04 47.09,25.04 47.24,24.89 48.51,24.89 SV8.9
LEDG_82
  Top 0.406: SV8.10 44.32,29.08 44.32,29.43 43.53,30.23 IC23.4
LEDG_83
  Top 0.406: SV8.11 48.67,27.58 46.78,27.58 46.41,27.95 46.24,27.95 44.88,29.31 44.88,30.14 43.53,31.5 IC23.5
LEDG_84
  Top 0.406: SV8.12 44.32,31.62 44.32,31.97 43.53,32.77 IC23.6
LEDG_85
  Top 0.406: IC23.10 37.77,31.5 41.56,35.28 42.9,35.28 42.93,35.31 44.32,35.31 44.88,34.74 44.88,34.39 45.61,33.67 45.78,33.67 46.78,32.66 48.36,32.66 SV8.13
LEDG_86
  Top 0.406: IC23.11 37.59,30.23 41.58,34.21 41.58,34.51 41.79,34.72 44.12,34.72 44.32,34.51 44.32,34.16 SV8.14
LEDG_87  (via drill 0.35)
  Top 0.406: IC23.12 v40.39,28.96
  Bottom 0.406: v40.39,28.96 44.96,28.96 46.13,30.12 47.71,30.12 48.36,30.78 48.36,32.36 SV8.15
LEDG_88  (via drill 0.35)
  Top 0.406: IC23.13 v38.61,27.69 | IC24.1 43.94,37.08 SV8.16
  Bottom 0.406: SV8.16 43.15,29.69 40.34,29.69 39.65,29.26 39.65,28.73 v38.61,27.69
LEDR_11
  Top 0.406: IC1.3 26.87,50.04 30.02,46.89 30.94,46.89 32.06,48.01 SV1.1
LEDR_12
  Top 0.406: IC1.4 27.18,51.31 SV1.2
LEDR_13
  Top 0.406: IC1.5 26.87,52.58 30.02,49.43 30.33,49.43 30.48,49.28 31.75,49.28 SV1.3
LEDR_14
  Top 0.406: IC1.6 27.18,53.85 SV1.4
LEDR_15
  Top 0.406: IC1.10 21.01,52.58 24.79,56.36 28.16,56.36 30.02,54.51 31.6,54.51 SV1.5
LEDR_16
  Top 0.406: IC1.11 20.62,51.31 24.82,55.5 24.82,55.59 25.02,55.8 27.76,55.8 SV1.6
LEDR_17  (via drill 0.35)
  Top 0.406: IC1.12 v22.86,50.04
  Bottom 0.406: v22.86,50.04 27.43,50.04 29.36,51.97 30.94,51.97 31.6,52.62 31.6,54.2 SV1.7
LEDR_18  (via drill 0.35)
  Top 0.406: IC1.13 v21.84,48.77 | IC2.1 27.69,58.42 SV1.8
  Bottom 0.406: SV1.8 25.37,51.28 22.56,50.77 22.13,50.34 22.13,49.05 v21.84,48.77
LEDR_21
  Top 0.406: IC4.3 43.63,50.04 46.78,46.89 47.71,46.89 48.83,48.01 SV2.1
LEDR_22
  Top 0.406: IC4.4 43.94,51.31 SV2.2
LEDR_23
  Top 0.406: IC4.5 43.63,52.58 46.78,49.43 47.09,49.43 47.24,49.28 48.51,49.28 SV2.3
LEDR_24
  Top 0.406: IC4.6 43.94,53.85 SV2.4
LEDR_25
  Top 0.406: IC4.10 37.77,52.58 41.56,56.36 44.93,56.36 46.78,54.51 48.36,54.51 SV2.5
LEDR_26
  Top 0.406: IC4.11 37.38,51.31 38.18,52.1 38.18,52.19 41.79,55.8 44.53,55.8 SV2.6
LEDR_27  (via drill 0.35)
  Top 0.406: IC4.12 v39.62,50.04
  Bottom 0.406: v39.62,50.04 44.2,50.04 46.13,51.97 47.71,51.97 48.36,52.62 48.36,54.2 SV2.7
LEDR_28  (via drill 0.35)
  Top 0.406: IC4.13 v38.61,48.77 | IC5.1 44.45,58.42 SV2.8
  Bottom 0.406: SV2.8 42.14,51.28 39.32,50.77 38.89,50.34 38.89,49.05 v38.61,48.77
LEDR_31
  Top 0.406: IC7.3 60.4,50.04 63.55,46.89 64.47,46.89 65.59,48.01 SV3.1
LEDR_32
  Top 0.406: IC7.4 60.71,51.31 SV3.2
LEDR_33
  Top 0.406: IC7.5 60.4,52.58 63.55,49.43 63.86,49.43 64.01,49.28 65.28,49.28 SV3.3
LEDR_34
  Top 0.406: IC7.6 60.71,53.85 SV3.4
LEDR_35
  Top 0.406: IC7.10 54.54,52.58 58.32,56.36 61.69,56.36 63.55,54.51 65.13,54.51 SV3.5
LEDR_36
  Top 0.406: IC7.11 54.15,51.31 58.34,55.5 58.34,55.59 58.55,55.8 61.29,55.8 SV3.6
LEDR_37  (via drill 0.35)
  Top 0.406: IC7.12 v56.39,50.04
  Bottom 0.406: v56.39,50.04 60.96,50.04 62.89,51.97 64.47,51.97 65.13,52.62 65.13,54.2 SV3.7
LEDR_38  (via drill 0.35)
  Top 0.406: IC7.13 v55.37,48.77 | IC8.1 61.21,58.42 SV3.8
  Bottom 0.406: SV3.8 58.9,51.28 56.08,50.77 55.65,50.34 55.65,49.05 v55.37,48.77
LEDR_41
  Top 0.406: IC10.3 77.16,50.04 80.31,46.89 81.23,46.89 82.35,48.01 SV4.1
LEDR_42
  Top 0.406: IC10.4 77.47,51.31 SV4.2
LEDR_43
  Top 0.406: IC10.5 77.16,52.58 80.31,49.43 80.62,49.43 80.77,49.28 82.04,49.28 SV4.3
LEDR_44
  Top 0.406: IC10.6 77.47,53.85 SV4.4
LEDR_45
  Top 0.406: IC10.10 71.3,52.58 75.08,56.36 78.45,56.36 80.31,54.51 81.89,54.51 SV4.5
LEDR_46
  Top 0.406: IC10.11 70.91,51.31 75.11,55.5 75.11,55.59 75.32,55.8 78.05,55.8 SV4.6
LEDR_47  (via drill 0.35)
  Top 0.406: IC10.12 v73.15,50.04
  Bottom 0.406: v73.15,50.04 77.72,50.04 79.65,51.97 81.23,51.97 81.89,52.62 81.89,54.2 SV4.7
LEDR_48  (via drill 0.35)  (1 unrouted)
  Top 0.406: IC11.1 77.98,58.42 SV4.8 | IC10.13 v72.14,48.77
  Bottom 0.406: SV4.8 75.66,51.28 72.85,50.77 72.42,50.34 72.42,49.05
LEDR_51
  Top 0.406: IC13.3 26.87,18.03 30.02,14.88 30.94,14.88 32.06,16 SV5.1
LEDR_52
  Top 0.406: IC13.4 27.18,19.3 SV5.2
LEDR_53
  Top 0.406: IC13.5 26.87,20.57 30.02,17.42 30.33,17.42 30.48,17.27 31.75,17.27 SV5.3
LEDR_54
  Top 0.406: IC13.6 27.18,21.84 SV5.4
LEDR_55
  Top 0.406: IC13.10 21.01,20.57 24.79,24.36 28.16,24.36 30.02,22.5 31.6,22.5 SV5.5
LEDR_56
  Top 0.406: IC13.11 20.62,19.3 24.82,23.5 24.82,23.59 25.02,23.8 27.76,23.8 SV5.6
LEDR_57  (via drill 0.35)
  Top 0.406: IC13.12 v22.86,18.03
  Bottom 0.406: v22.86,18.03 27.43,18.03 29.36,19.96 30.94,19.96 31.6,20.62 31.6,22.2 SV5.7
LEDR_58  (via drill 0.35)
  Top 0.406: IC13.13 v21.84,16.76 | IC14.1 27.69,26.42 SV5.8
  Bottom 0.406: SV5.8 25.37,19.28 22.56,18.77 22.13,18.34 22.13,17.05 v21.84,16.76
LEDR_61
  Top 0.406: IC16.3 60.4,18.03 63.55,14.88 64.47,14.88 65.59,16 SV6.1
LEDR_62
  Top 0.406: IC16.4 60.71,19.3 SV6.2
LEDR_63
  Top 0.406: IC16.5 60.4,20.57 63.55,17.42 63.86,17.42 64.01,17.27 65.28,17.27 SV6.3
LEDR_64
  Top 0.406: IC16.6 60.71,21.84 SV6.4
LEDR_65
  Top 0.406: IC16.10 54.54,20.57 58.32,24.36 61.69,24.36 63.55,22.5 65.13,22.5 SV6.5
LEDR_66
  Top 0.406: IC16.11 54.15,19.3 58.34,23.5 58.34,23.59 58.55,23.8 61.29,23.8 SV6.6
LEDR_67  (via drill 0.35)
  Top 0.406: IC16.12 v56.39,18.03
  Bottom 0.406: v56.39,18.03 60.96,18.03 62.89,19.96 64.47,19.96 65.13,20.62 65.13,22.2 SV6.7
LEDR_68  (via drill 0.35)
  Top 0.406: IC16.13 v55.37,16.76 | IC17.1 61.21,26.42 SV6.8
  Bottom 0.406: SV6.8 58.9,19.28 56.08,18.77 55.65,18.34 55.65,17.05 v55.37,16.76
LEDR_71
  Top 0.406: IC19.3 77.16,18.03 80.31,14.88 81.23,14.88 82.35,16 SV7.1
LEDR_72
  Top 0.406: IC19.4 77.47,19.3 SV7.2
LEDR_73
  Top 0.406: IC19.5 77.16,20.57 80.31,17.42 80.62,17.42 80.77,17.27 82.04,17.27 SV7.3
LEDR_74
  Top 0.406: IC19.6 77.47,21.84 SV7.4
LEDR_75
  Top 0.406: IC19.10 71.3,20.57 75.08,24.36 78.45,24.36 80.31,22.5 81.89,22.5 SV7.5
LEDR_76
  Top 0.406: IC19.11 70.91,19.3 75.11,23.5 75.11,23.59 75.32,23.8 78.05,23.8 SV7.6
LEDR_77  (via drill 0.35)
  Top 0.406: IC19.12 v73.15,18.03
  Bottom 0.406: v73.15,18.03 77.72,18.03 79.65,19.96 81.23,19.96 81.89,20.62 81.89,22.2 SV7.7
LEDR_78  (via drill 0.35)
  Top 0.406: IC19.13 v72.14,16.76 | IC20.1 77.98,26.42 SV7.8
  Bottom 0.406: SV7.8 75.66,19.28 72.85,18.77 72.42,18.34 72.42,17.05 v72.14,16.76
LEDR_81
  Top 0.406: IC22.3 43.63,18.03 46.78,14.88 47.71,14.88 48.83,16 SV8.1
LEDR_82
  Top 0.406: IC22.4 43.94,19.3 SV8.2
LEDR_83
  Top 0.406: IC22.5 43.63,20.57 46.78,17.42 47.09,17.42 47.24,17.27 48.51,17.27 SV8.3
LEDR_84
  Top 0.406: IC22.6 43.94,21.84 SV8.4
LEDR_85
  Top 0.406: IC22.10 37.77,20.57 41.56,24.36 44.93,24.36 46.78,22.5 48.36,22.5 SV8.5
LEDR_86
  Top 0.406: IC22.11 37.38,19.3 41.58,23.5 41.58,23.59 41.79,23.8 44.53,23.8 SV8.6
LEDR_87  (via drill 0.35)
  Top 0.406: IC22.12 v39.62,18.03
  Bottom 0.406: v39.62,18.03 44.2,18.03 46.13,19.96 47.71,19.96 48.36,20.62 48.36,22.2 SV8.7
LEDR_88  (via drill 0.35)
  Top 0.406: IC22.13 v38.61,16.76 | IC23.1 44.45,26.42 SV8.8
  Bottom 0.406: SV8.8 42.14,19.28 39.32,18.77 38.89,18.34 38.89,17.05 v38.61,16.76
N$26  (3 unrouted)
N$49  (3 unrouted)
N$50  (3 unrouted)
N$51  (3 unrouted)
N$52  (3 unrouted)
N$53  (3 unrouted)
N$55  (3 unrouted)
REF  (9 unrouted)
SCL_1  (4 unrouted)
SCL_2  (4 unrouted)
SDA_1  (4 unrouted)
SDA_2  (4 unrouted)
SEN11  (1 unrouted)
SEN12  (1 unrouted)
SEN13  (1 unrouted)
SEN14  (1 unrouted)
SEN15  (1 unrouted)
SEN16  (1 unrouted)
SEN17  (1 unrouted)
SEN18  (1 unrouted)
VCC  (24 unrouted)